# EAGLE design led_table_final (EAGLE 7.6.0)
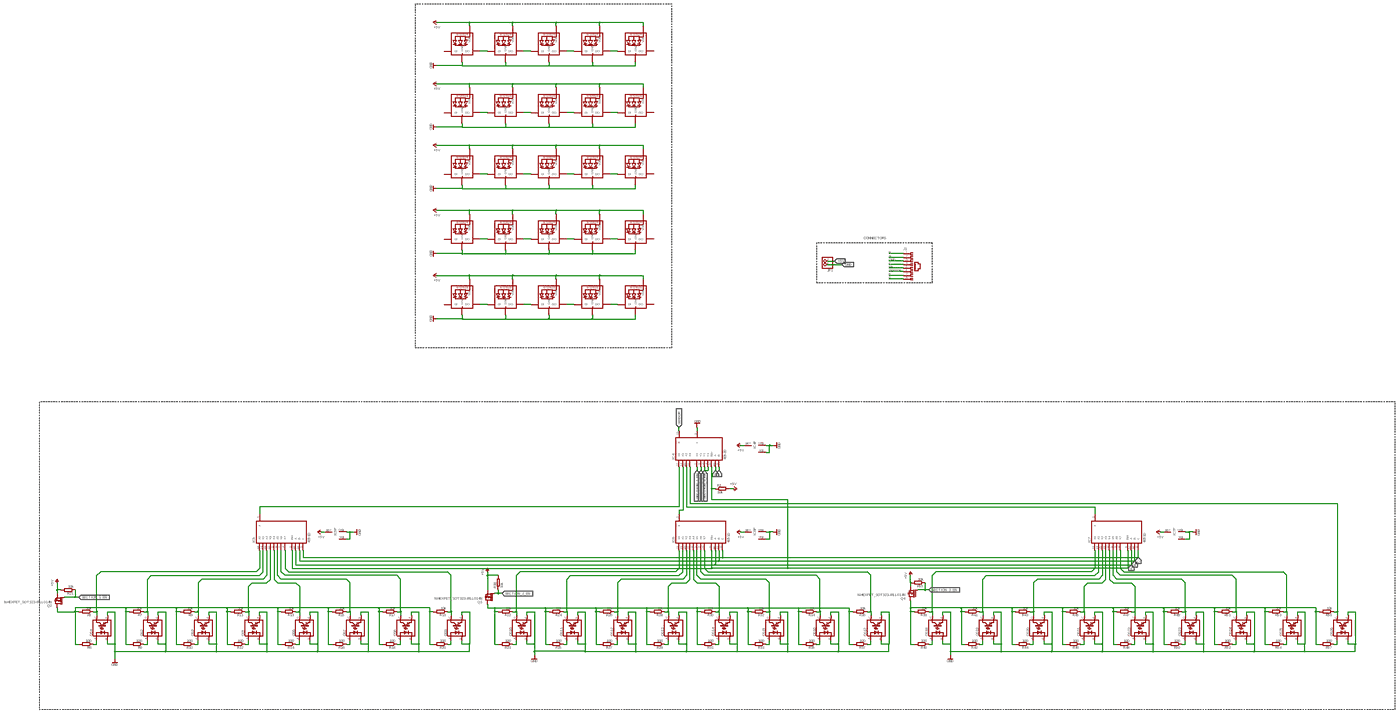
[diagram p0: schematic, sheet 1, overview]
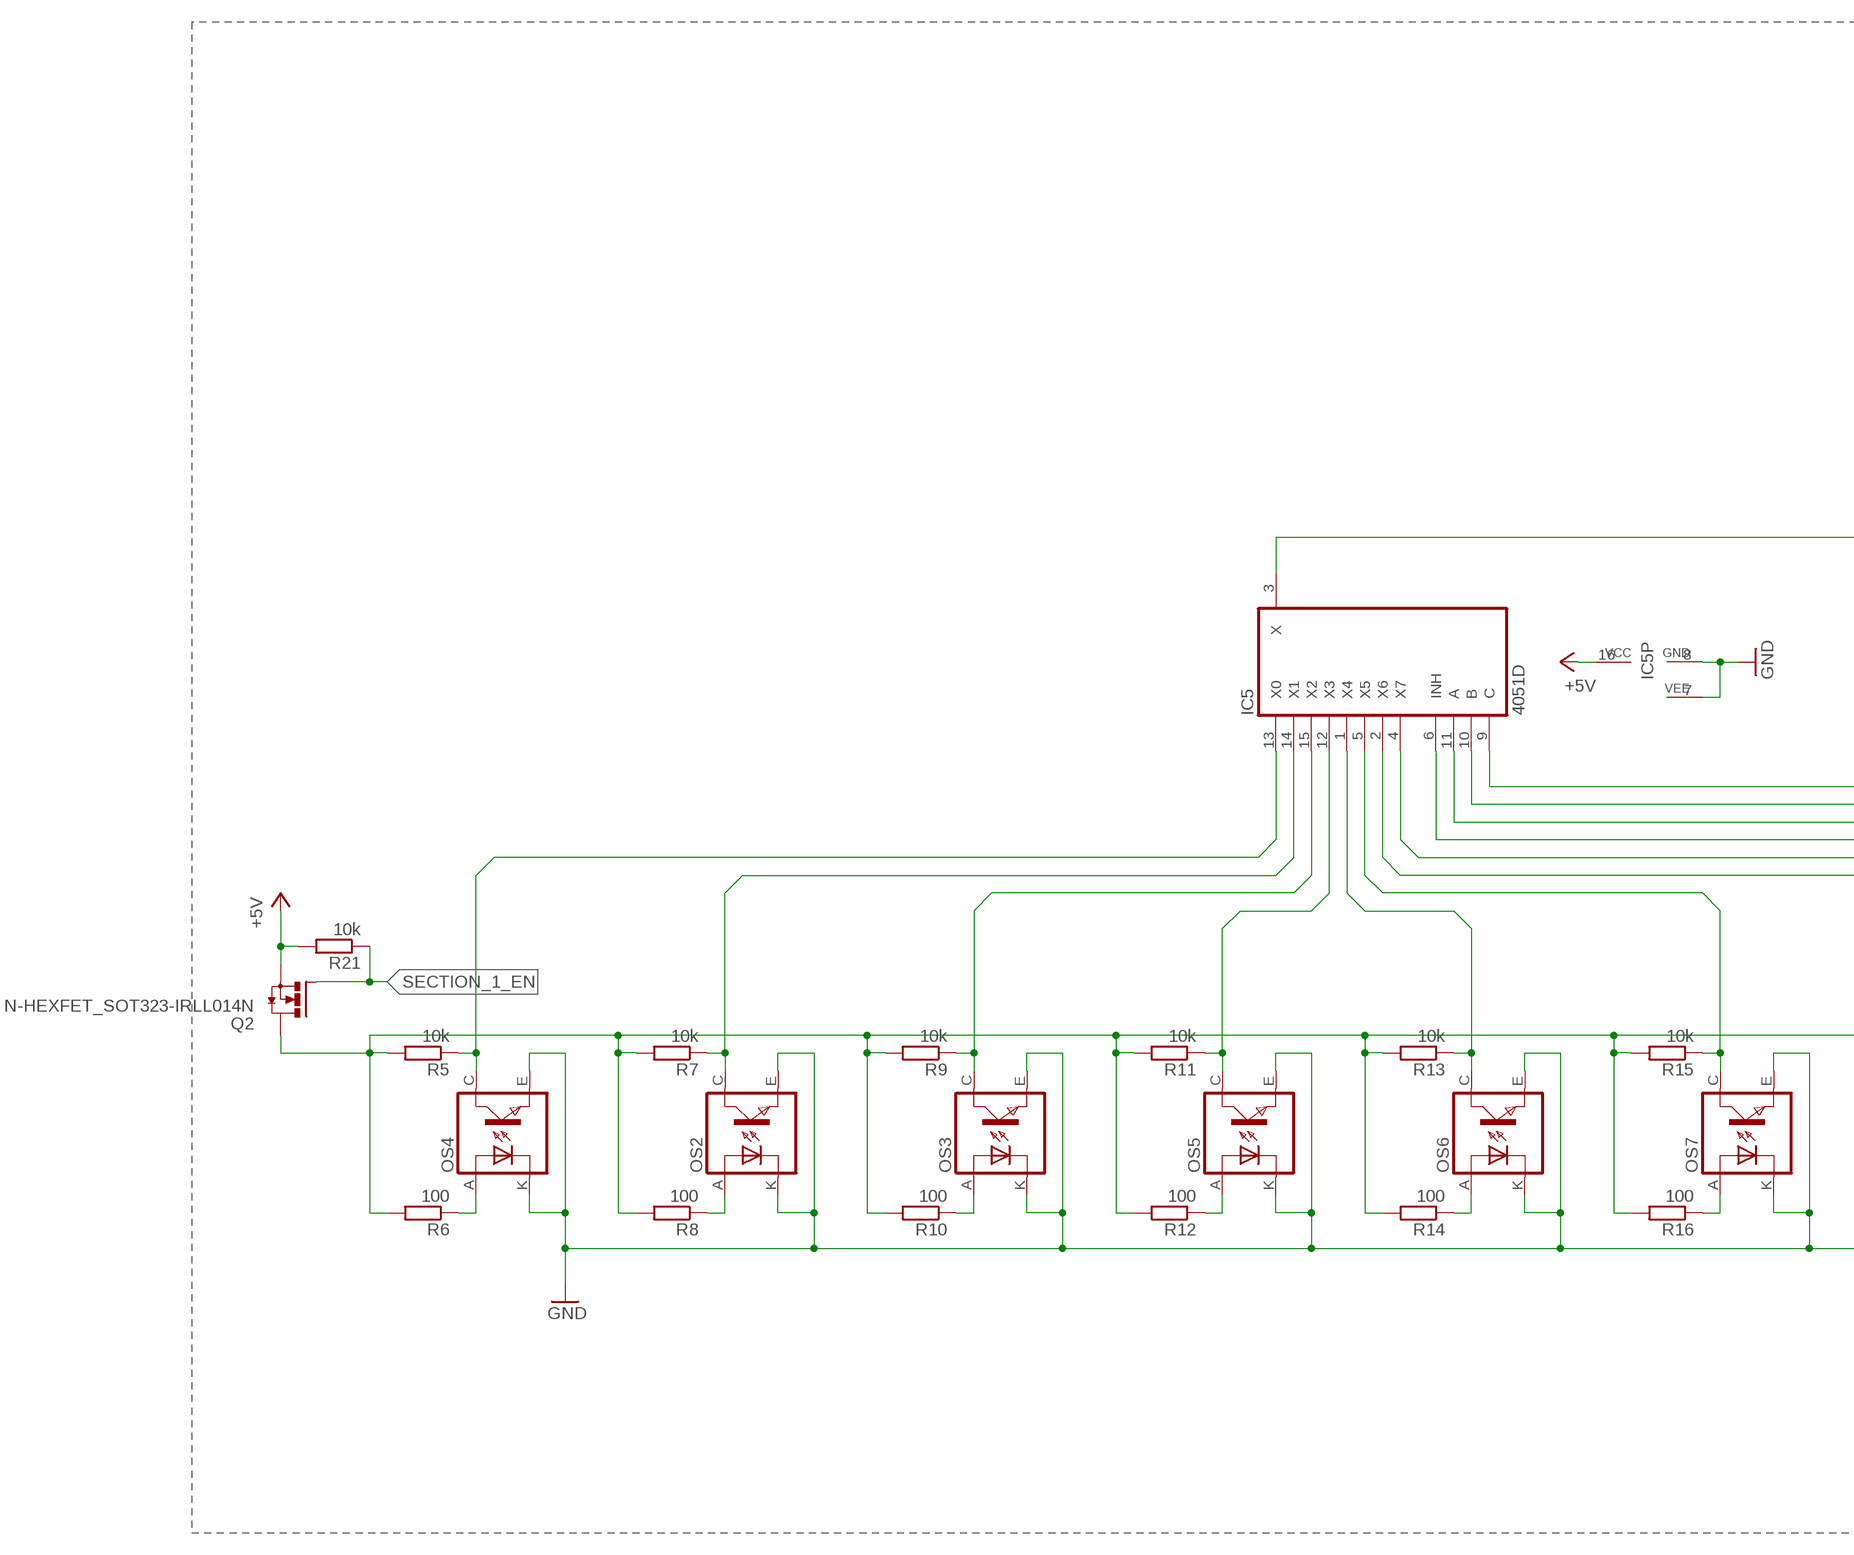
[diagram p1: schematic, sheet 1, part 1 of 4]
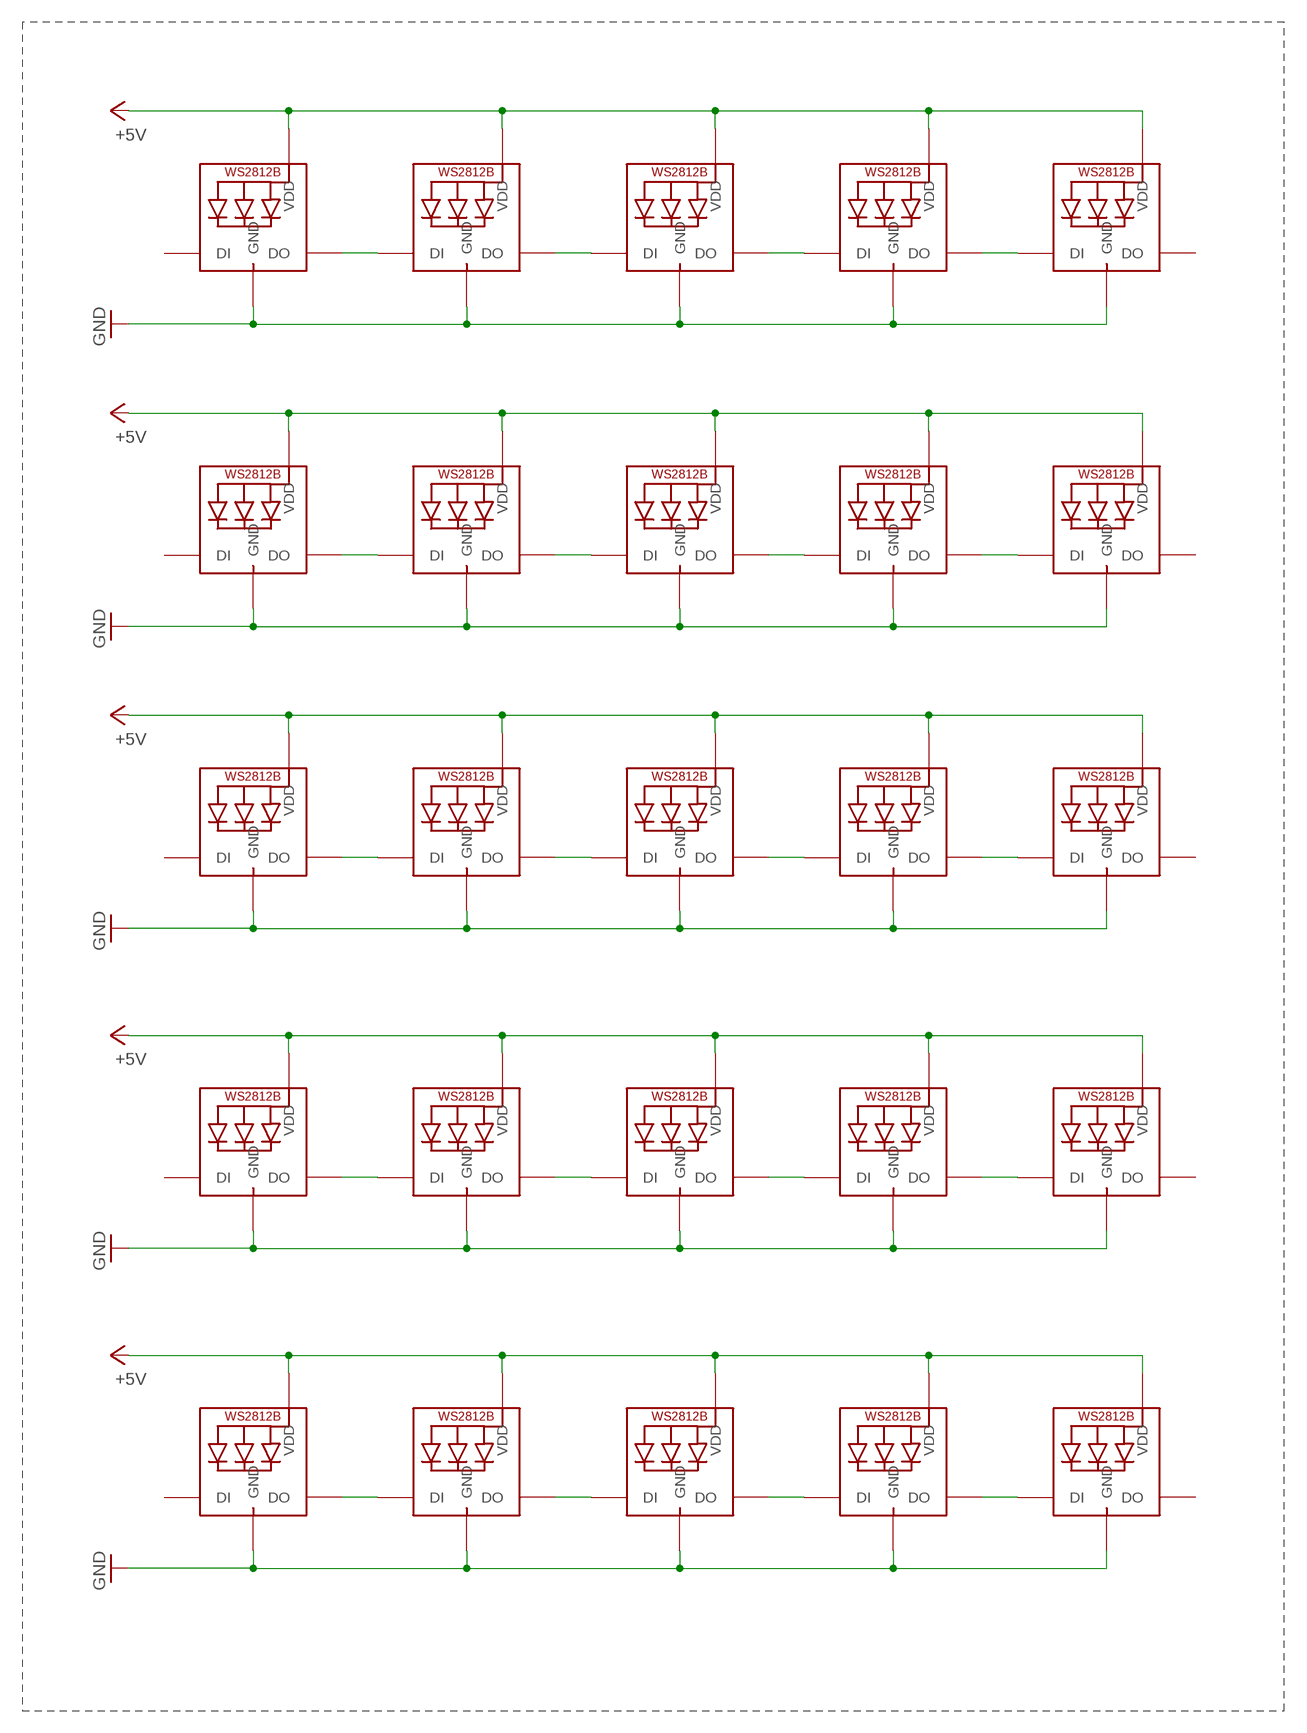
[diagram p2: schematic, sheet 1, part 2 of 4]
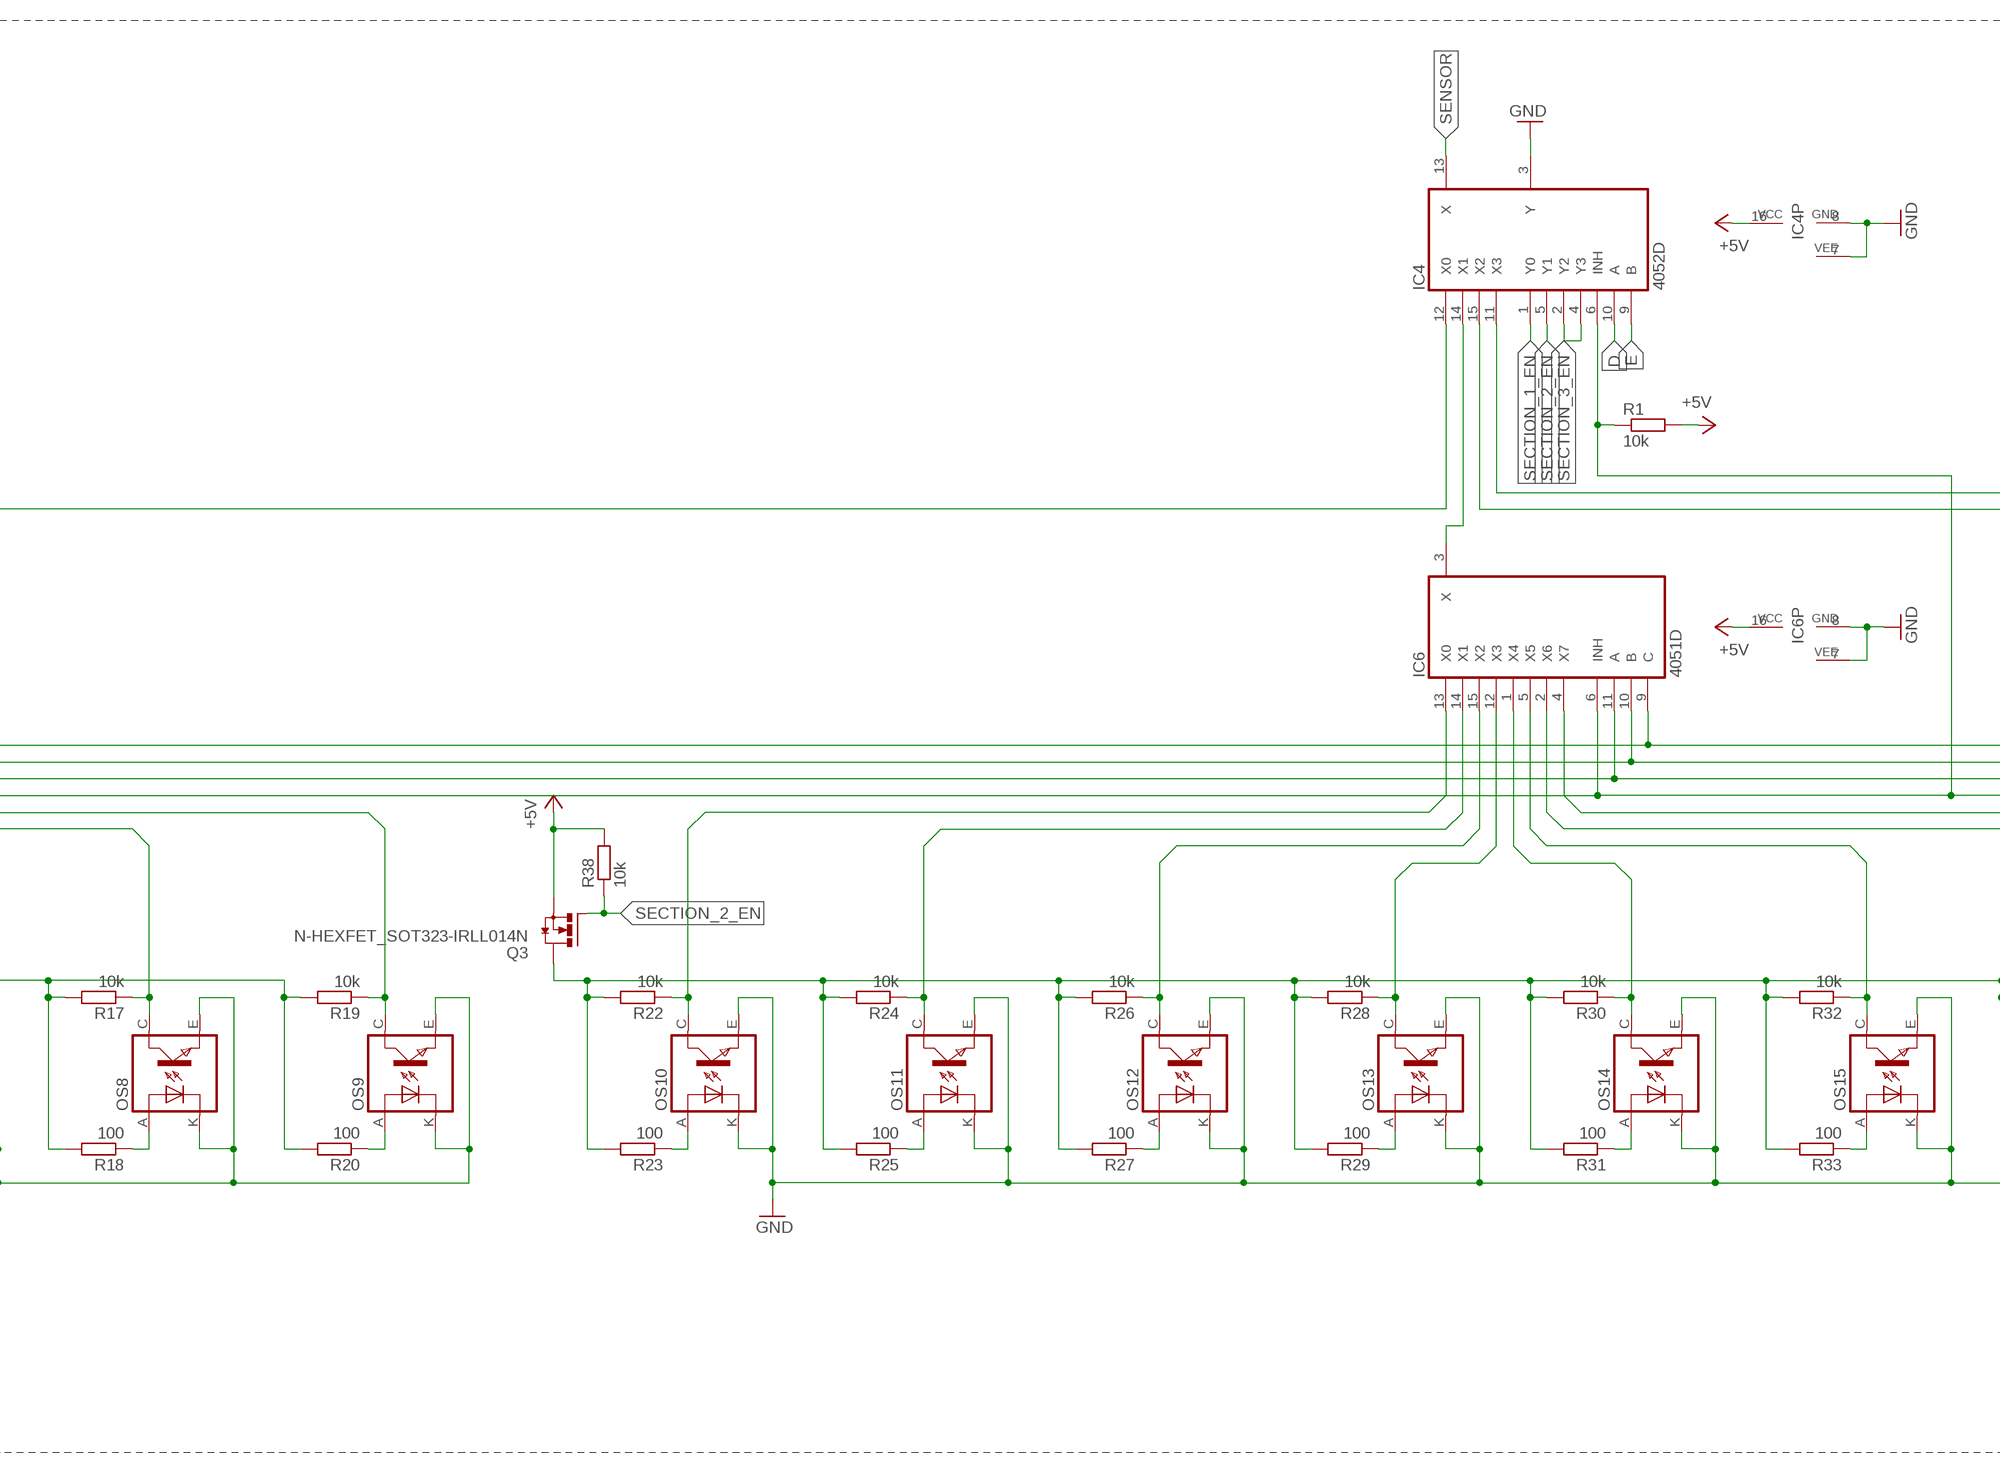
[diagram p3: schematic, sheet 1, part 3 of 4]
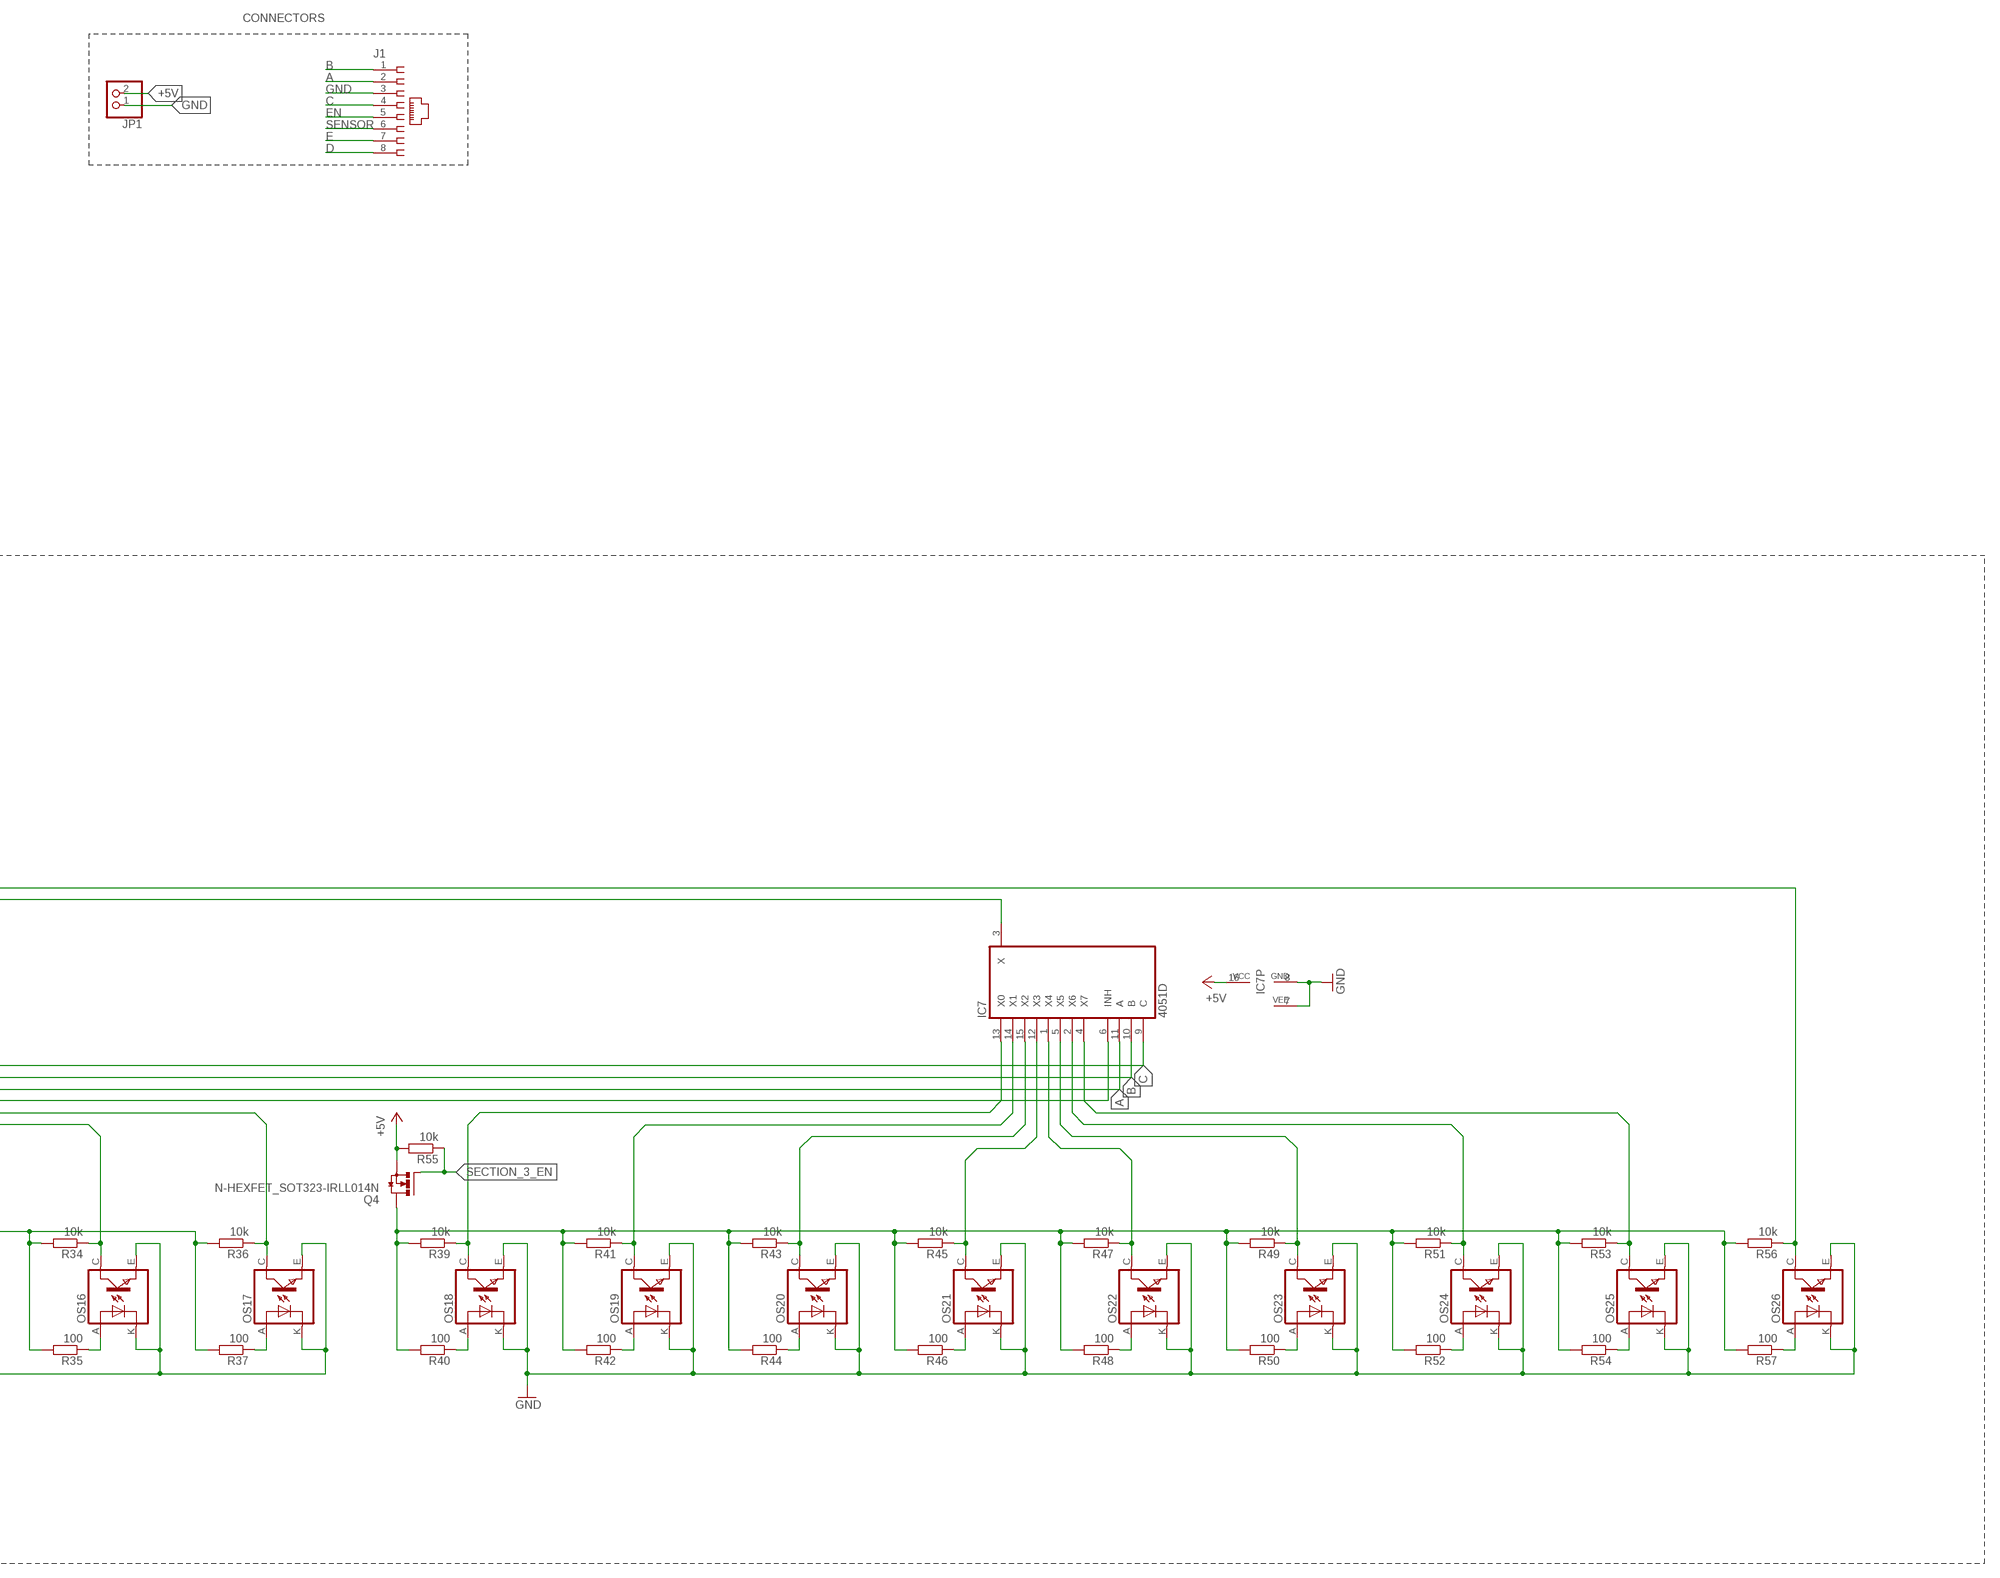
[diagram p4: schematic, sheet 1, part 4 of 4]

## Parts
IC4  4052D  [SO16]
IC5  4051D  [SO16]
IC6  4051D  [SO16]
IC7  4051D  [SO16]
J1  556416-1  [556416-1]
JP1  PINHD-1X2  [1X02]
LED1  WS2812B  [WS2812B_ON_STRIP]
LED2  WS2812B  [WS2812B_ON_STRIP]
LED3  WS2812B  [WS2812B_ON_STRIP]
LED4  WS2812B  [WS2812B_ON_STRIP]
LED5  WS2812B  [WS2812B_ON_STRIP]
LED6  WS2812B  [WS2812B_ON_STRIP]
LED7  WS2812B  [WS2812B_ON_STRIP]
LED8  WS2812B  [WS2812B_ON_STRIP]
LED9  WS2812B  [WS2812B_ON_STRIP]
LED10  WS2812B  [WS2812B_ON_STRIP]
LED11  WS2812B  [WS2812B_ON_STRIP]
LED12  WS2812B  [WS2812B_ON_STRIP]
LED13  WS2812B  [WS2812B_ON_STRIP]
LED14  WS2812B  [WS2812B_ON_STRIP]
LED15  WS2812B  [WS2812B_ON_STRIP]
LED16  WS2812B  [WS2812B_ON_STRIP]
LED17  WS2812B  [WS2812B_ON_STRIP]
LED18  WS2812B  [WS2812B_ON_STRIP]
LED19  WS2812B  [WS2812B_ON_STRIP]
LED20  WS2812B  [WS2812B_ON_STRIP]
LED21  WS2812B  [WS2812B_ON_STRIP]
LED22  WS2812B  [WS2812B_ON_STRIP]
LED23  WS2812B  [WS2812B_ON_STRIP]
LED24  WS2812B  [WS2812B_ON_STRIP]
LED25  WS2812B  [WS2812B_ON_STRIP]
OS2  TCRT5000  [TCRT5000]
OS3  TCRT5000  [TCRT5000]
OS4  TCRT5000  [TCRT5000]
OS5  TCRT5000  [TCRT5000]
OS6  TCRT5000  [TCRT5000]
OS7  TCRT5000  [TCRT5000]
OS8  TCRT5000  [TCRT5000]
OS9  TCRT5000  [TCRT5000]
OS10  TCRT5000  [TCRT5000]
OS11  TCRT5000  [TCRT5000]
OS12  TCRT5000  [TCRT5000]
OS13  TCRT5000  [TCRT5000]
OS14  TCRT5000  [TCRT5000]
OS15  TCRT5000  [TCRT5000]
OS16  TCRT5000  [TCRT5000]
OS17  TCRT5000  [TCRT5000]
OS18  TCRT5000  [TCRT5000]
OS19  TCRT5000  [TCRT5000]
OS20  TCRT5000  [TCRT5000]
OS21  TCRT5000  [TCRT5000]
OS22  TCRT5000  [TCRT5000]
OS23  TCRT5000  [TCRT5000]
OS24  TCRT5000  [TCRT5000]
OS25  TCRT5000  [TCRT5000]
OS26  TCRT5000  [TCRT5000]
Q2  N-HEXFET_SOT323-IRLL014N  [SOT223]
Q3  N-HEXFET_SOT323-IRLL014N  [SOT223]
Q4  N-HEXFET_SOT323-IRLL014N  [SOT223]
R1  10k  R-EU_R1206  [R1206]
R5  10k  R-EU_R1206  [R1206]
R6  100  R-EU_R1206  [R1206]
R7  10k  R-EU_R1206  [R1206]
R8  100  R-EU_R1206  [R1206]
R9  10k  R-EU_R1206  [R1206]
R10  100  R-EU_R1206  [R1206]
R11  10k  R-EU_R1206  [R1206]
R12  100  R-EU_R1206  [R1206]
R13  10k  R-EU_R1206  [R1206]
R14  100  R-EU_R1206  [R1206]
R15  10k  R-EU_R1206  [R1206]
R16  100  R-EU_R1206  [R1206]
R17  10k  R-EU_R1206  [R1206]
R18  100  R-EU_R1206  [R1206]
R19  10k  R-EU_R1206  [R1206]
R20  100  R-EU_R1206  [R1206]
R21  10k  R-EU_R1206  [R1206]
R22  10k  R-EU_R1206  [R1206]
R23  100  R-EU_R1206  [R1206]
R24  10k  R-EU_R1206  [R1206]
R25  100  R-EU_R1206  [R1206]
R26  10k  R-EU_R1206  [R1206]
R27  100  R-EU_R1206  [R1206]
R28  10k  R-EU_R1206  [R1206]
R29  100  R-EU_R1206  [R1206]
R30  10k  R-EU_R1206  [R1206]
R31  100  R-EU_R1206  [R1206]
R32  10k  R-EU_R1206  [R1206]
R33  100  R-EU_R1206  [R1206]
R34  10k  R-EU_R1206  [R1206]
R35  100  R-EU_R1206  [R1206]
R36  10k  R-EU_R1206  [R1206]
R37  100  R-EU_R1206  [R1206]
R38  10k  R-EU_R1206  [R1206]
R39  10k  R-EU_R1206  [R1206]
R40  100  R-EU_R1206  [R1206]
R41  10k  R-EU_R1206  [R1206]
R42  100  R-EU_R1206  [R1206]
R43  10k  R-EU_R1206  [R1206]
R44  100  R-EU_R1206  [R1206]
R45  10k  R-EU_R1206  [R1206]
R46  100  R-EU_R1206  [R1206]
R47  10k  R-EU_R1206  [R1206]
R48  100  R-EU_R1206  [R1206]
R49  10k  R-EU_R1206  [R1206]
R50  100  R-EU_R1206  [R1206]
R51  10k  R-EU_R1206  [R1206]
R52  100  R-EU_R1206  [R1206]
R53  10k  R-EU_R1206  [R1206]
R54  100  R-EU_R1206  [R1206]
R55  10k  R-EU_R1206  [R1206]
R56  10k  R-EU_R1206  [R1206]
R57  100  R-EU_R1206  [R1206]

## Nets
+5V: IC4.16(VCC) IC5.16(VCC) IC6.16(VCC) IC7.16(VCC) JP1.2 LED1.VCC_IN(VDD) LED1.VCC_OUT(VDD) LED2.VCC_IN(VDD) LED2.VCC_OUT(VDD) LED3.VCC_IN(VDD) LED3.VCC_OUT(VDD) LED4.VCC_IN(VDD) LED4.VCC_OUT(VDD) LED5.VCC_IN(VDD) LED5.VCC_OUT(VDD) LED6.VCC_IN(VDD) LED6.VCC_OUT(VDD) LED7.VCC_IN(VDD) LED7.VCC_OUT(VDD) LED8.VCC_IN(VDD) LED8.VCC_OUT(VDD) LED9.VCC_IN(VDD) LED9.VCC_OUT(VDD) LED10.VCC_IN(VDD) LED10.VCC_OUT(VDD) LED11.VCC_IN(VDD) LED11.VCC_OUT(VDD) LED12.VCC_IN(VDD) LED12.VCC_OUT(VDD) LED13.VCC_IN(VDD) LED13.VCC_OUT(VDD) LED14.VCC_IN(VDD) LED14.VCC_OUT(VDD) LED15.VCC_IN(VDD) LED15.VCC_OUT(VDD) LED16.VCC_IN(VDD) LED16.VCC_OUT(VDD) LED17.VCC_IN(VDD) LED17.VCC_OUT(VDD) LED18.VCC_IN(VDD) LED18.VCC_OUT(VDD) LED19.VCC_IN(VDD) LED19.VCC_OUT(VDD) LED20.VCC_IN(VDD) LED20.VCC_OUT(VDD) LED21.VCC_IN(VDD) LED21.VCC_OUT(VDD) LED22.VCC_IN(VDD) LED22.VCC_OUT(VDD) LED23.VCC_IN(VDD) LED23.VCC_OUT(VDD) LED24.VCC_IN(VDD) LED24.VCC_OUT(VDD) LED25.VCC_IN(VDD) LED25.VCC_OUT(VDD) Q2.3(S) Q3.3(S) Q4.3(S) R1.2 R21.2 R38.2 R55.2
A: IC5.11(A) IC6.11(A) IC7.11(A) J1.2
B: IC5.10(B) IC6.10(B) IC7.10(B) J1.1
C: IC5.9(C) IC6.9(C) IC7.9(C) J1.4
D: IC4.10(A) J1.8
E: IC4.9(B) J1.7
EN: IC4.6(INH) IC5.6(INH) IC6.6(INH) IC7.6(INH) J1.5 R1.1
GND: IC4.3(Y) IC4.7(VEE) IC4.8(GND) IC5.7(VEE) IC5.8(GND) IC6.7(VEE) IC6.8(GND) IC7.7(VEE) IC7.8(GND) J1.3 JP1.1 LED1.GND_IN(GND) LED1.GND_OUT(GND) LED2.GND_IN(GND) LED2.GND_OUT(GND) LED3.GND_IN(GND) LED3.GND_OUT(GND) LED4.GND_IN(GND) LED4.GND_OUT(GND) LED5.GND_IN(GND) LED5.GND_OUT(GND) LED6.GND_IN(GND) LED6.GND_OUT(GND) LED7.GND_IN(GND) LED7.GND_OUT(GND) LED8.GND_IN(GND) LED8.GND_OUT(GND) LED9.GND_IN(GND) LED9.GND_OUT(GND) LED10.GND_IN(GND) LED10.GND_OUT(GND) LED11.GND_IN(GND) LED11.GND_OUT(GND) LED12.GND_IN(GND) LED12.GND_OUT(GND) LED13.GND_IN(GND) LED13.GND_OUT(GND) LED14.GND_IN(GND) LED14.GND_OUT(GND) LED15.GND_IN(GND) LED15.GND_OUT(GND) LED16.GND_IN(GND) LED16.GND_OUT(GND) LED17.GND_IN(GND) LED17.GND_OUT(GND) LED18.GND_IN(GND) LED18.GND_OUT(GND) LED19.GND_IN(GND) LED19.GND_OUT(GND) LED20.GND_IN(GND) LED20.GND_OUT(GND) LED21.GND_IN(GND) LED21.GND_OUT(GND) LED22.GND_IN(GND) LED22.GND_OUT(GND) LED23.GND_IN(GND) LED23.GND_OUT(GND) LED24.GND_IN(GND) LED24.GND_OUT(GND) LED25.GND_IN(GND) LED25.GND_OUT(GND) OS2.E(EMITTER) OS2.K(CATHODE) OS3.E(EMITTER) OS3.K(CATHODE) OS4.E(EMITTER) OS4.K(CATHODE) OS5.E(EMITTER) OS5.K(CATHODE) OS6.E(EMITTER) OS6.K(CATHODE) OS7.E(EMITTER) OS7.K(CATHODE) OS8.E(EMITTER) OS8.K(CATHODE) OS9.E(EMITTER) OS9.K(CATHODE) OS10.E(EMITTER) OS10.K(CATHODE) OS11.E(EMITTER) OS11.K(CATHODE) OS12.E(EMITTER) OS12.K(CATHODE) OS13.E(EMITTER) OS13.K(CATHODE) OS14.E(EMITTER) OS14.K(CATHODE) OS15.E(EMITTER) OS15.K(CATHODE) OS16.E(EMITTER) OS16.K(CATHODE) OS17.E(EMITTER) OS17.K(CATHODE) OS18.E(EMITTER) OS18.K(CATHODE) OS19.E(EMITTER) OS19.K(CATHODE) OS20.E(EMITTER) OS20.K(CATHODE) OS21.E(EMITTER) OS21.K(CATHODE) OS22.E(EMITTER) OS22.K(CATHODE) OS23.E(EMITTER) OS23.K(CATHODE) OS24.E(EMITTER) OS24.K(CATHODE) OS25.E(EMITTER) OS25.K(CATHODE) OS26.E(EMITTER) OS26.K(CATHODE)
N$1: Q3.4(D) R22.2 R23.2 R24.2 R25.2 R26.2 R27.2 R28.2 R29.2 R30.2 R31.2 R32.2 R33.2 R34.2 R35.2 R36.2 R37.2
N$7: Q2.4(D) R5.2 R6.2 R7.2 R8.2 R9.2 R10.2 R11.2 R12.2 R13.2 R14.2 R15.2 R16.2 R17.2 R18.2 R19.2 R20.2
N$11: OS4.A(ANODE) R6.1
N$12: IC5.13(X0) OS4.C(COLLECTOR) R5.1
N$13: IC5.14(X1) OS2.C(COLLECTOR) R7.1
N$14: IC5.15(X2) OS3.C(COLLECTOR) R9.1
N$15: OS2.A(ANODE) R8.1
N$16: IC5.1(X4) OS6.C(COLLECTOR) R13.1
N$17: IC6.13(X0) OS10.C(COLLECTOR) R22.1
N$18: OS3.A(ANODE) R10.1
N$19: OS10.A(ANODE) R23.1
N$20: IC5.12(X3) OS5.C(COLLECTOR) R11.1
N$21: OS5.A(ANODE) R12.1
N$22: IC6.14(X1) OS11.C(COLLECTOR) R24.1
N$23: OS11.A(ANODE) R25.1
N$24: OS6.A(ANODE) R14.1
N$25: OS12.A(ANODE) R27.1
N$26: IC5.5(X5) OS7.C(COLLECTOR) R15.1
N$27: OS7.A(ANODE) R16.1
N$28: IC6.12(X3) OS13.C(COLLECTOR) R28.1
N$29: IC5.2(X6) OS8.C(COLLECTOR) R17.1
N$30: OS8.A(ANODE) R18.1
N$32: IC5.4(X7) OS9.C(COLLECTOR) R19.1
N$33: OS9.A(ANODE) R20.1
N$34: OS13.A(ANODE) R29.1
N$36: OS14.A(ANODE) R31.1
N$37: IC6.5(X5) OS15.C(COLLECTOR) R32.1
N$38: OS15.A(ANODE) R33.1
N$39: IC6.2(X6) OS16.C(COLLECTOR) R34.1
N$40: OS16.A(ANODE) R35.1
N$42: IC6.4(X7) OS17.C(COLLECTOR) R36.1
N$43: OS17.A(ANODE) R37.1
N$45: IC6.15(X2) OS12.C(COLLECTOR) R26.1
N$46: IC6.1(X4) OS14.C(COLLECTOR) R30.1
N$47: IC7.13(X0) OS18.C(COLLECTOR) R39.1
N$48: OS18.A(ANODE) R40.1
N$49: IC7.14(X1) OS19.C(COLLECTOR) R41.1
N$50: OS19.A(ANODE) R42.1
N$51: OS20.A(ANODE) R44.1
N$52: IC7.12(X3) OS21.C(COLLECTOR) R45.1
N$53: OS21.A(ANODE) R46.1
N$54: OS22.A(ANODE) R48.1
N$55: IC7.5(X5) OS23.C(COLLECTOR) R49.1
N$56: OS23.A(ANODE) R50.1
N$57: IC7.2(X6) OS24.C(COLLECTOR) R51.1
N$58: OS24.A(ANODE) R52.1
N$60: IC7.4(X7) OS25.C(COLLECTOR) R53.1
N$61: OS25.A(ANODE) R54.1
N$63: IC7.15(X2) OS20.C(COLLECTOR) R43.1
N$64: IC7.1(X4) OS22.C(COLLECTOR) R47.1
N$68: Q4.4(D) R39.2 R40.2 R41.2 R42.2 R43.2 R44.2 R45.2 R46.2 R47.2 R48.2 R49.2 R50.2 R51.2 R52.2 R53.2 R54.2 R56.2 R57.2
N$69: IC4.12(X0) IC5.3(X)
N$70: IC4.14(X1) IC6.3(X)
N$71: IC4.15(X2) IC7.3(X)
N$72: IC4.11(X3) OS26.C(COLLECTOR) R56.1
N$75: OS26.A(ANODE) R57.1
N$117: LED1.D_OUT(DO) LED2.D_IN(DI)
N$118: LED2.D_OUT(DO) LED3.D_IN(DI)
N$119: LED3.D_OUT(DO) LED4.D_IN(DI)
N$120: LED4.D_OUT(DO) LED5.D_IN(DI)
N$123: LED6.D_OUT(DO) LED7.D_IN(DI)
N$124: LED7.D_OUT(DO) LED8.D_IN(DI)
N$125: LED8.D_OUT(DO) LED9.D_IN(DI)
N$126: LED9.D_OUT(DO) LED10.D_IN(DI)
N$127: LED11.D_OUT(DO) LED12.D_IN(DI)
N$128: LED12.D_OUT(DO) LED13.D_IN(DI)
N$129: LED13.D_OUT(DO) LED14.D_IN(DI)
N$130: LED14.D_OUT(DO) LED15.D_IN(DI)
N$131: LED16.D_OUT(DO) LED17.D_IN(DI)
N$132: LED17.D_OUT(DO) LED18.D_IN(DI)
N$133: LED18.D_OUT(DO) LED19.D_IN(DI)
N$134: LED19.D_OUT(DO) LED20.D_IN(DI)
N$135: LED21.D_OUT(DO) LED22.D_IN(DI)
N$136: LED22.D_OUT(DO) LED23.D_IN(DI)
N$137: LED23.D_OUT(DO) LED24.D_IN(DI)
N$138: LED24.D_OUT(DO) LED25.D_IN(DI)
SECTION_1_EN: IC4.1(Y0) Q2.1(G) R21.1
SECTION_2_EN: IC4.5(Y1) Q3.1(G) R38.1
SECTION_3_EN: IC4.2(Y2) IC4.4(Y3) Q4.1(G) R55.1
SENSOR: IC4.13(X) J1.6
Unconnected: LED1.D_IN(DI) LED5.D_OUT(DO) LED6.D_IN(DI) LED10.D_OUT(DO) LED11.D_IN(DI) LED15.D_OUT(DO) LED16.D_IN(DI) LED20.D_OUT(DO) LED21.D_IN(DI) LED25.D_OUT(DO)

## Notes on the sheet
- CONNECTORS

## Library data of the parts
IC4 = 40xx:4052: Dual 4-channel ANALOG MULTIPLEXER
IC5-IC7 = 40xx:4051: 8-channel ANALOG MULTIPLEXER
J1 = con-amp:556416-1: AMP connector
JP1 = pinhead:PINHD-1X2: PIN HEADER
LED1-LED25 = adafruit:WS2812B
OS2-OS26 = tcrt5000:TCRT5000
Q2-Q4 = transistor-power:N-HEXFET_?-*: HEXFET® Power MOSFET
R1 R5-R57 = rcl:R-EU_: RESISTOR, European symbol

## Board
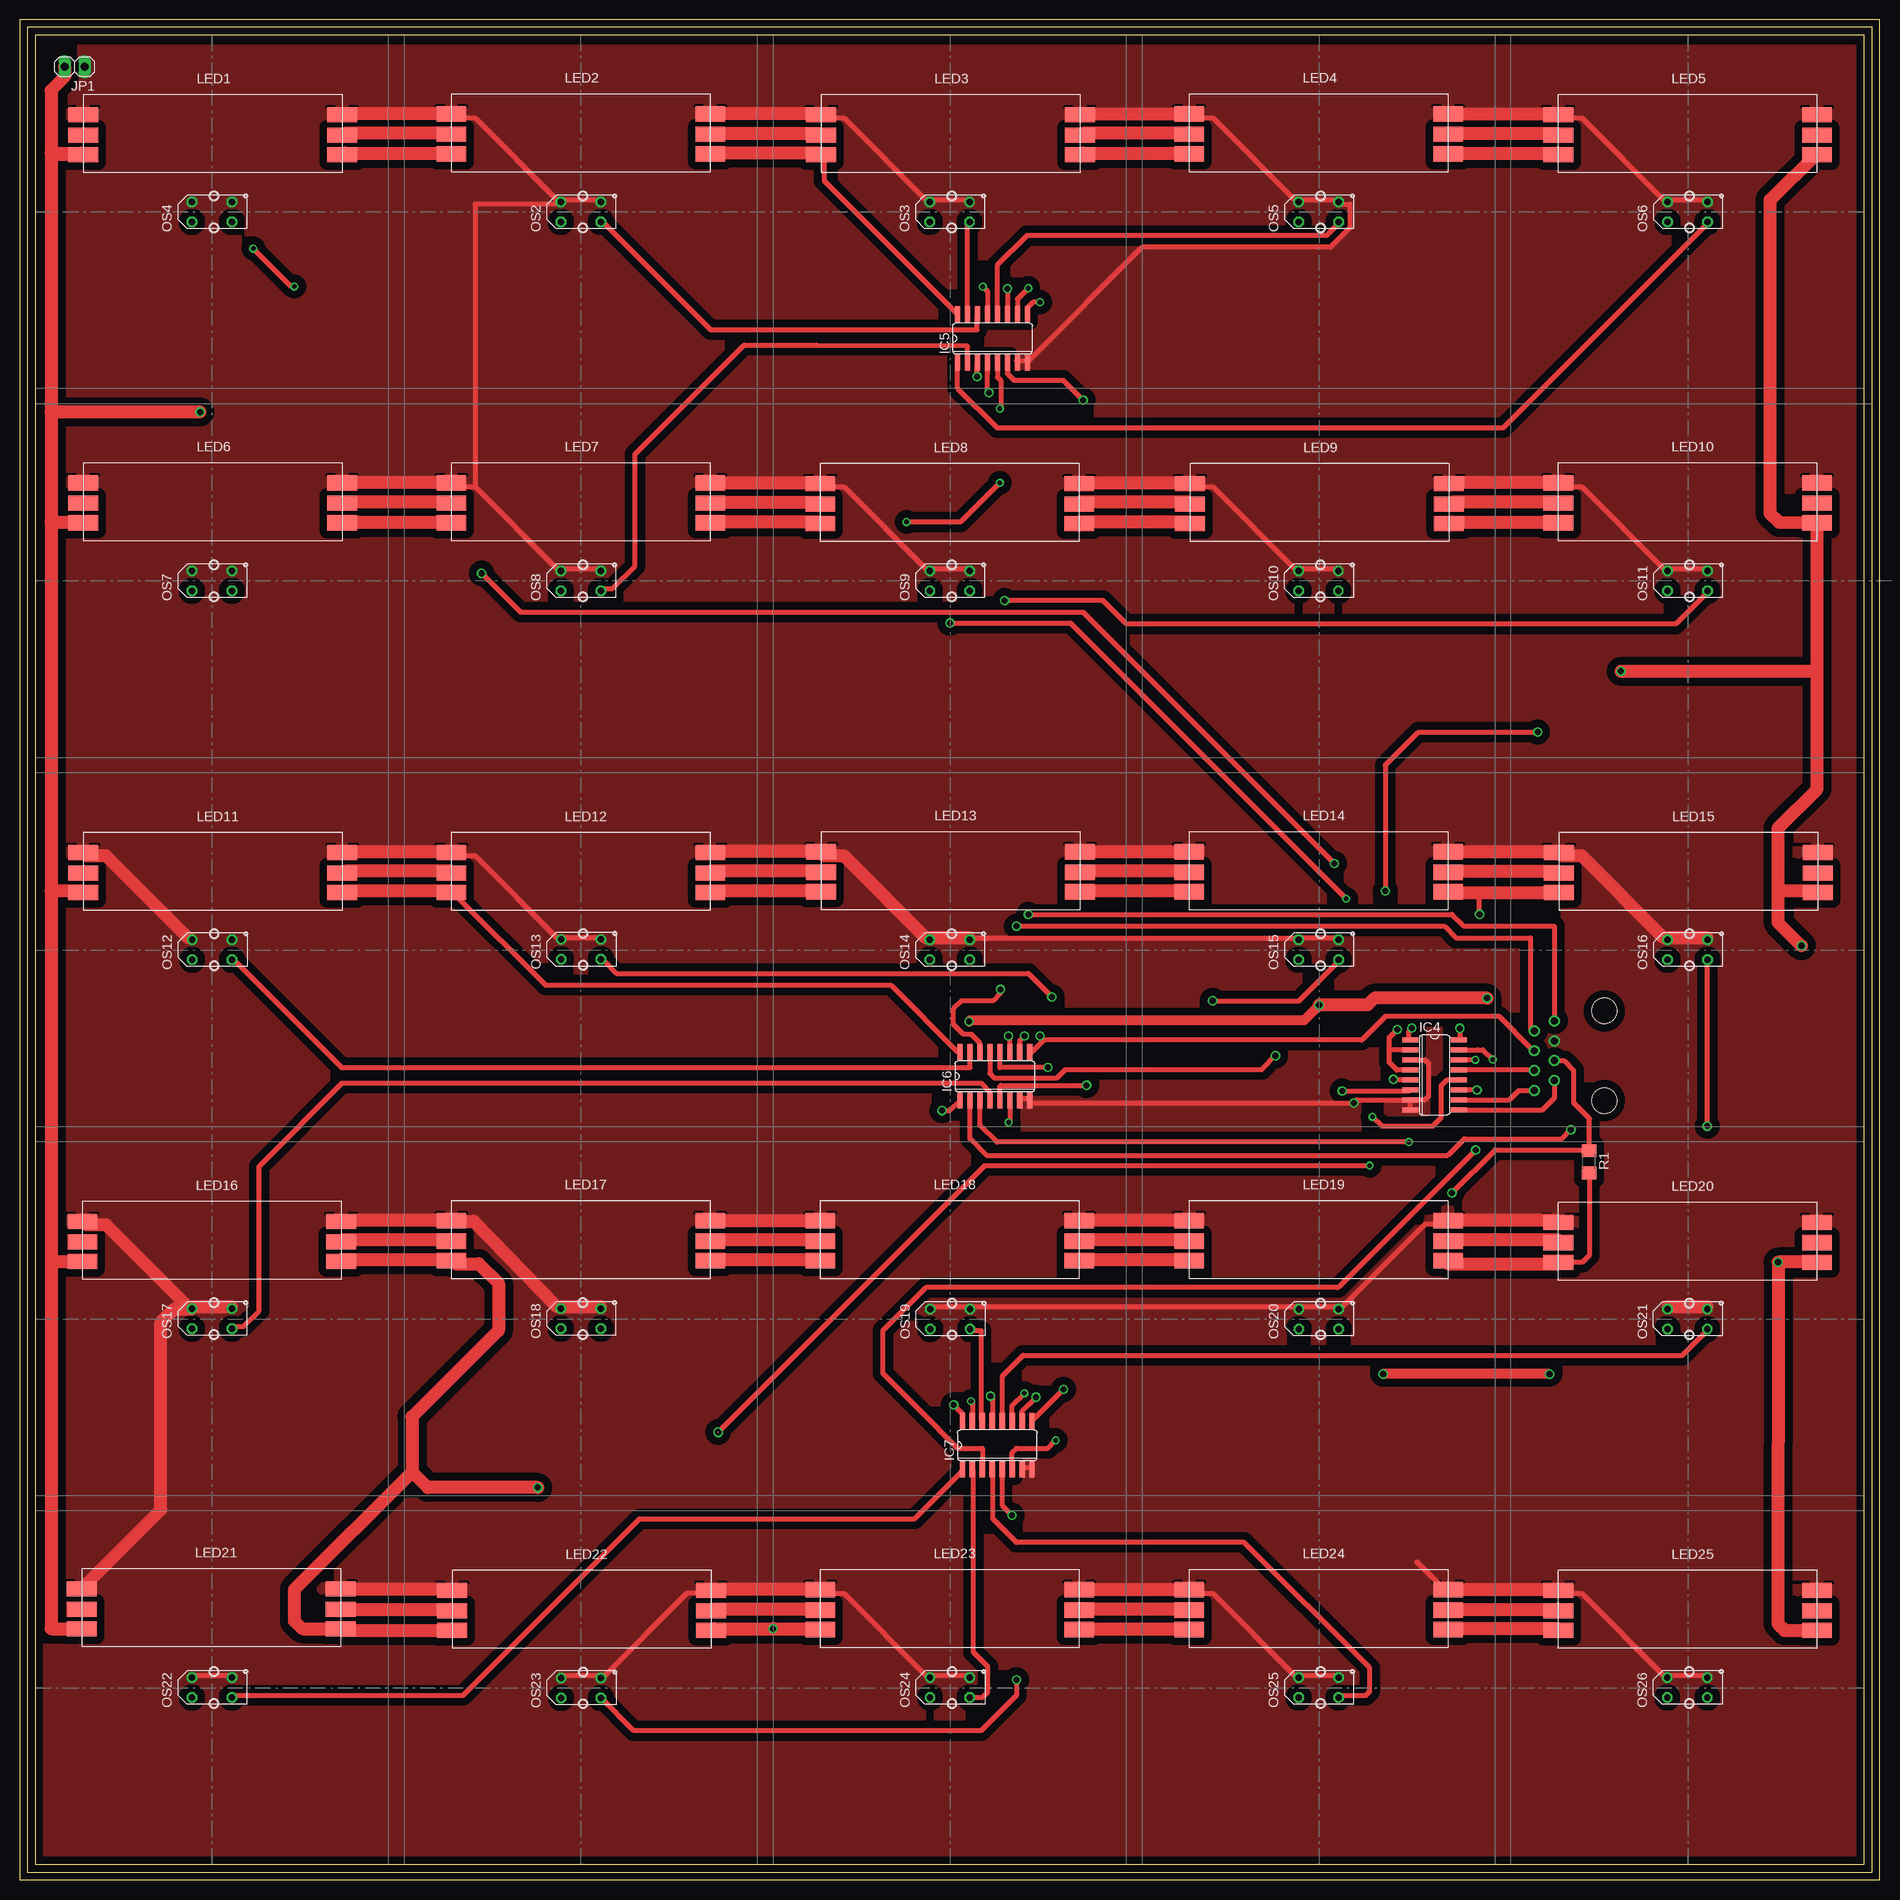
[diagram p5: board, top side]
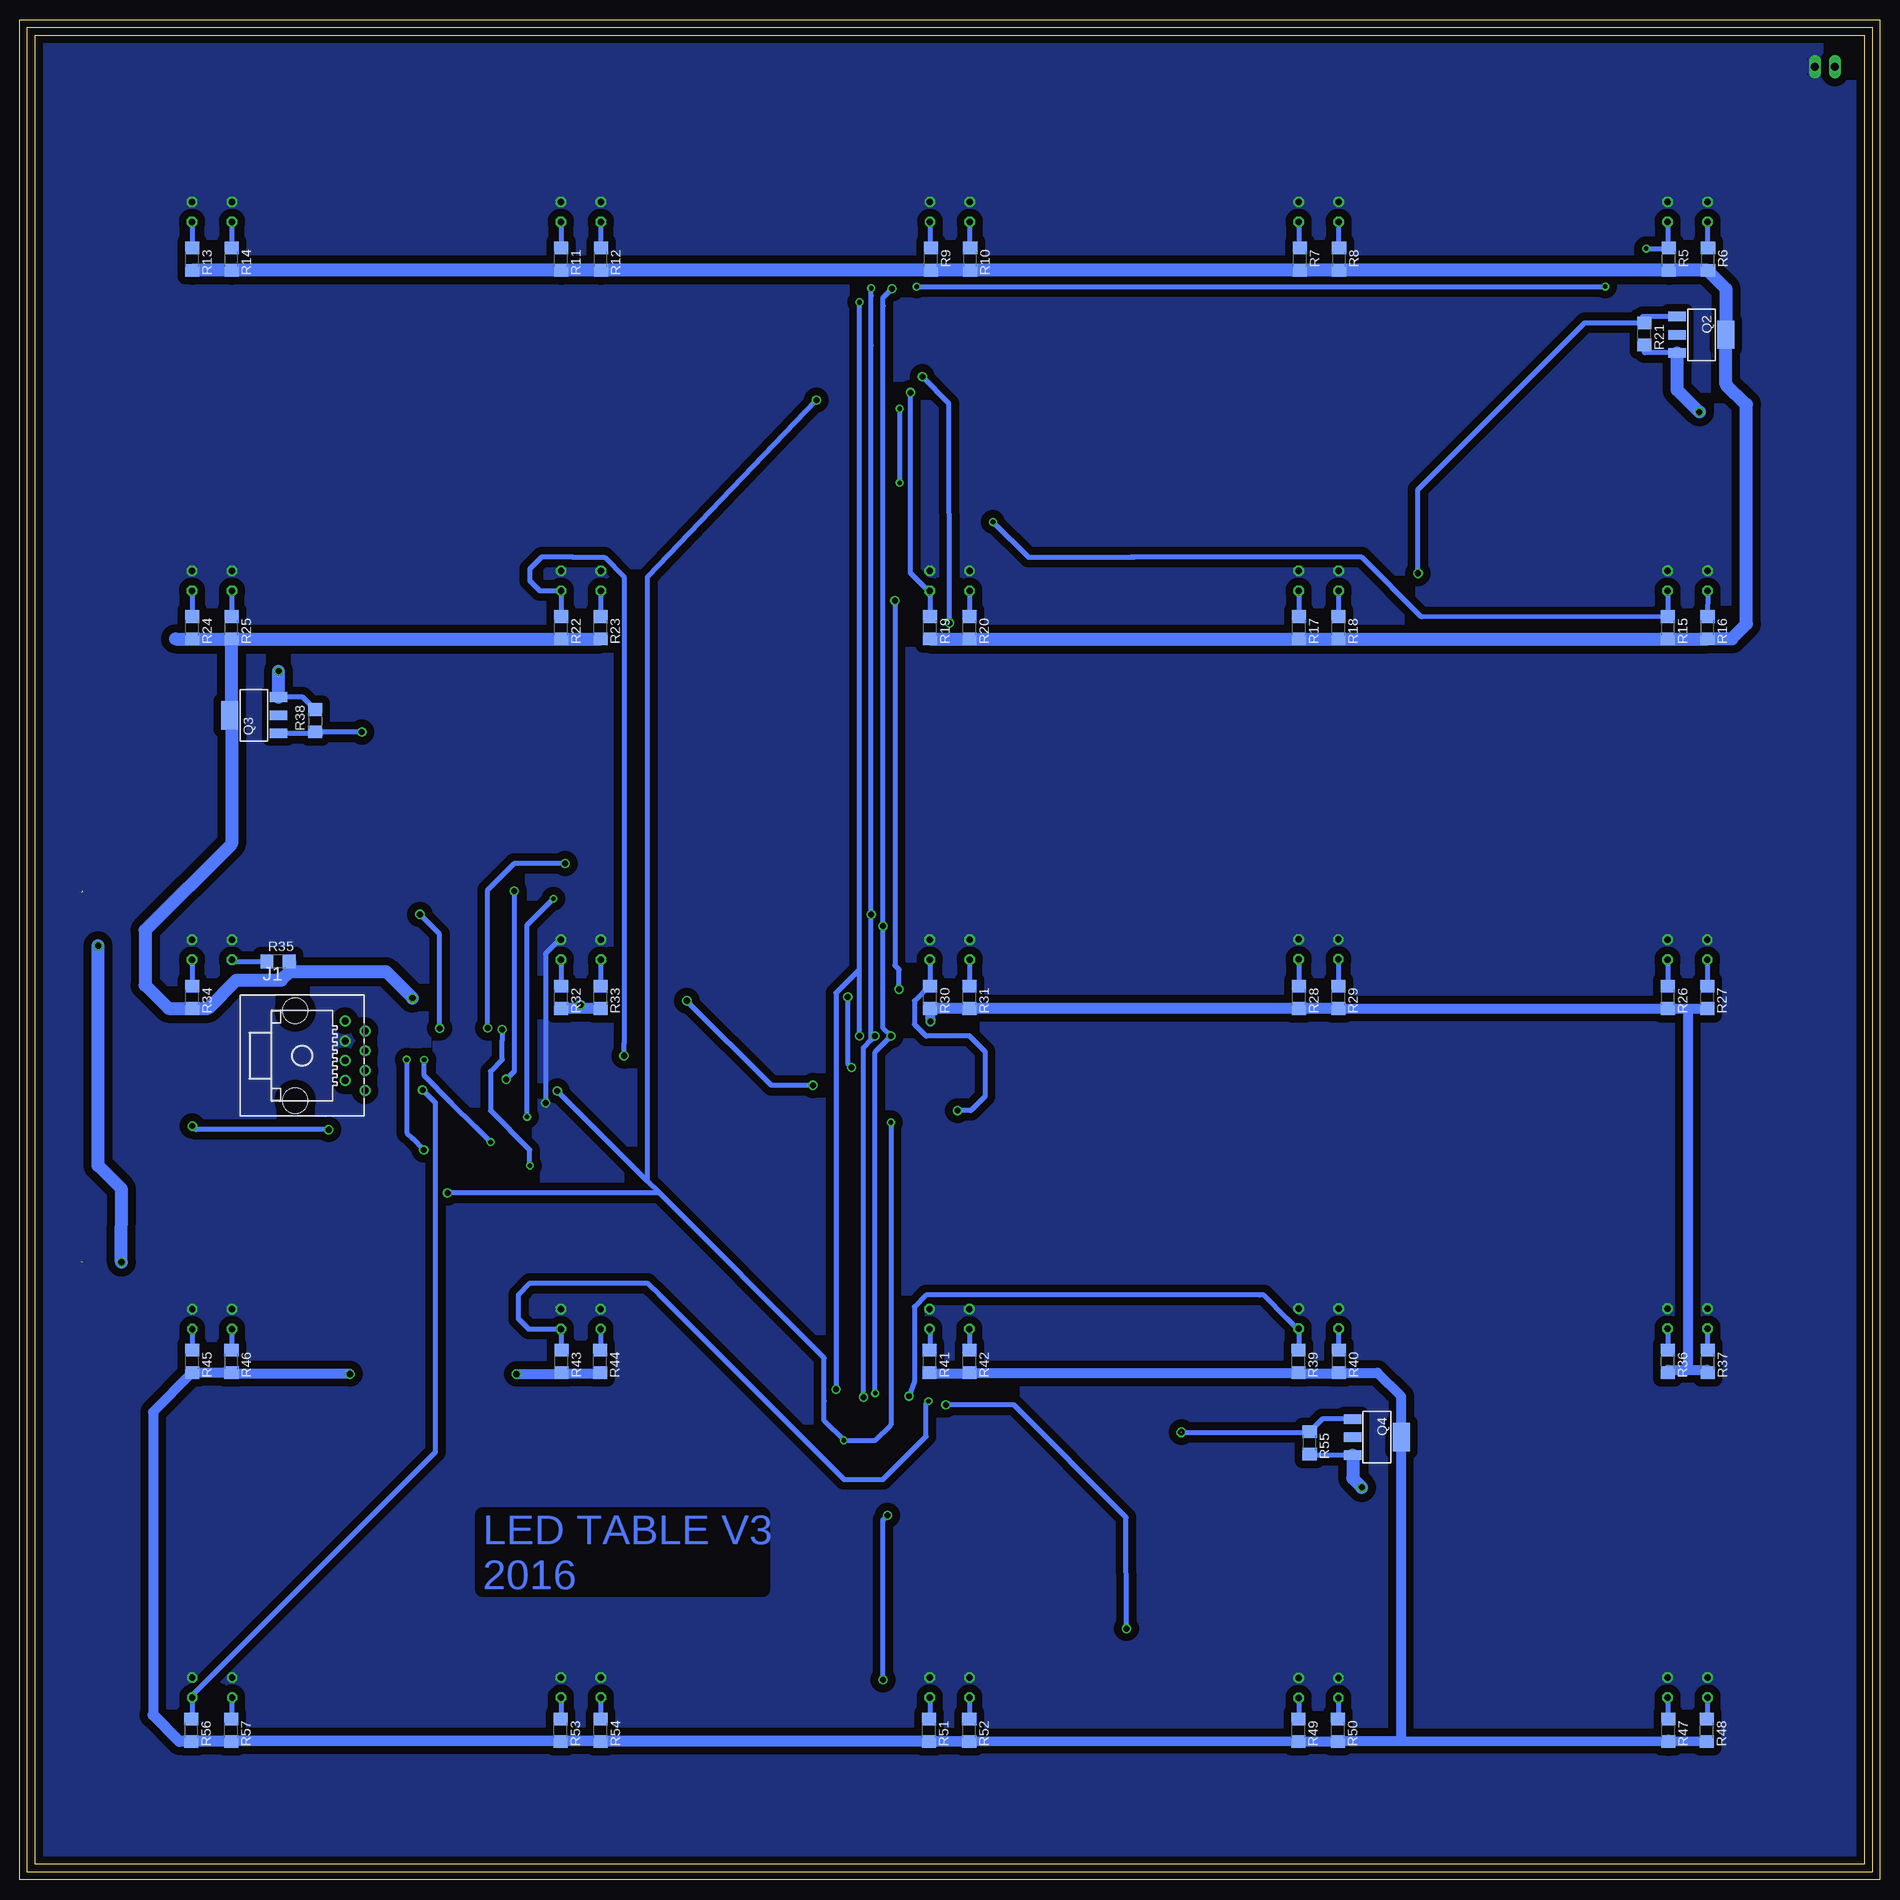
[diagram p6: board, bottom side, seen from below]

Size 237 x 237 mm. Coordinates in mm from the lower left corner, seen from the top.
Outline: 235,235 2,235 2,2 235,2 235,235
Outline: 1,236 1,1 236,1 236,236 1,236
Outline: 0,237 0,0 237,0 237,237 0,237
Copper layers (1*16): Top 0.035mm / dielectric 1.5mm / Bottom 0.035mm
Design rules "default *": minimum track width 25mil, minimum drill 30mil, track to track 15mil, track to pad 15mil, pad to pad 8mil, via to via 8mil, smd to smd 8mil, copper to edge 20mil, drill to drill 8mil, minimum pad ring 10mil, minimum via ring 8mil, stop-mask expansion 4mil, vias tented up to drill 0mil, thermal gap 10mil

### Footprints (pad centres in the part's own frame; a part is rotated, then mirrored left to right if it is on the bottom)
SO16 = smd 0.66 x 2.032: 1 -4.445,-3.073; 2 -3.175,-3.073; 3 -1.905,-3.073; 4 -0.635,-3.073; 5 0.635,-3.073; 6 1.905,-3.073; 7 3.175,-3.073; 8 4.445,-3.073; 9 4.445,3.073; 10 3.175,3.073; 11 1.905,3.073; 12 0.635,3.073; 13 -0.635,3.073; 14 -1.905,3.073; 15 -3.175,3.073; 16 -4.445,3.073
556416-1 = drill 0.889: 1 -4.445,5.461; 2 -3.175,8.001; 3 -1.905,5.461; 4 -0.635,8.001; 5 0.635,5.461; 6 1.905,8.001; 7 3.175,5.461; 8 4.445,8.001 | hole 3.251: -5.715,-0.889; 5.715,-0.889
1X02 = drill 1.016 long: 1 -1.27,0; 2 1.27,0
WS2812B_ON_STRIP = smd 1.93 x 3.81: D_IN 0.12,-16.49; D_OUT 0.12,16.49; GND_IN -2.48,-16.49; GND_OUT -2.48,16.49; VCC_IN 2.62,-16.49; VCC_OUT 2.62,16.49
TCRT5000 = drill 0.8 octagon: A -2.54,-1.27; C 2.54,-1.27; E 2.54,1.27; K -2.54,1.27
SOT223 = smd 1.219 x 2.235: 1 -2.311,-3.099; 2 0,-3.099; 3 2.311,-3.099 | smd 3.6 x 2.2: 4 0,3.099
R1206 = smd 1.6 x 1.803: 1 -1.422,0; 2 1.422,0

### Placement (x,y rotation side)
IC4  180.28,102.54 270 top
IC5  123.95,196.38 0 top
IC6  124.25,102.38 0 top
IC7  124.55,55.38 0 top
J1  201,105 270 bottom
JP1  7,231 180 top
LED1  24.6,222.4 270 top
LED2  71.5,222.5 270 top
LED3  118.6,222.4 270 top
LED4  165.5,222.5 270 top
LED5  212.5,222.4 270 top
LED6  24.6,175.5 270 top
LED7  71.5,175.5 270 top
LED8  118.5,175.4 270 top
LED9  165.6,175.4 270 top
LED10  212.5,175.5 270 top
LED11  24.6,128.4 270 top
LED12  71.5,128.4 270 top
LED13  118.6,128.5 270 top
LED14  165.5,128.5 270 top
LED15  212.6,128.4 270 top
LED16  24.5,81.4 270 top
LED17  71.5,81.5 270 top
LED18  118.5,81.5 270 top
LED19  165.5,81.5 270 top
LED20  212.5,81.3 270 top
LED21  24.4,34.6 270 top
LED22  71.6,34.4 270 top
LED23  118.5,34.5 270 top
LED24  165.5,34.5 270 top
LED25  212.5,34.4 270 top
OS2  71.5,212.5 0 top
OS3  118.49,212.5 0 top
OS4  24.5,212.5 0 top
OS5  165.5,212.5 0 top
OS6  212.5,212.5 0 top
OS7  24.5,165.5 0 top
OS8  71.5,165.5 0 top
OS9  118.51,165.5 0 top
OS10  165.48,165.5 0 top
OS11  212.5,165.5 0 top
OS12  24.52,118.5 0 top
OS13  71.52,118.55 0 top
OS14  118.5,118.5 0 top
OS15  165.5,118.5 0 top
OS16  212.5,118.5 0 top
OS17  24.5,71.5 0 top
OS18  71.5,71.5 0 top
OS19  118.54,71.45 0 top
OS20  165.51,71.45 0 top
OS21  212.48,71.45 0 top
OS22  24.5,24.5 0 top
OS23  71.52,24.45 0 top
OS24  118.52,24.5 0 top
OS25  165.49,24.5 0 top
OS26  212.46,24.5 0 top
Q2  22.72,196.85 270 bottom
Q3  207.15,148.38 90 bottom
Q4  64.07,56.41 270 bottom
R1  199.96,91.49 270 top
R5  26.89,206.49 270 bottom
R6  21.89,206.49 270 bottom
R7  73.89,206.49 270 bottom
R8  68.89,206.49 270 bottom
R9  120.89,206.49 270 bottom
R10  115.89,206.49 270 bottom
R11  168.01,206.49 270 bottom
R12  162.94,206.49 270 bottom
R13  215,206.49 270 bottom
R14  210,206.49 270 bottom
R15  27,159.52 270 bottom
R16  21.96,159.52 270 bottom
R17  74,159.52 270 bottom
R18  69,159.52 270 bottom
R19  121,159.52 270 bottom
R20  116,159.52 270 bottom
R21  30,196.96 270 bottom
R22  168,159.52 270 bottom
R23  163,159.52 270 bottom
R24  215,159.52 270 bottom
R25  210,159.52 270 bottom
R26  27,112.44 270 bottom
R27  22,112.44 270 bottom
R28  74,112.44 270 bottom
R29  69,112.44 270 bottom
R30  121,112.44 270 bottom
R31  116,112.44 270 bottom
R32  168,112.44 270 bottom
R33  163,112.44 270 bottom
R34  215,112.44 270 bottom
R35  204.08,117 0 bottom
R36  27.01,66.04 270 bottom
R37  21.93,66.04 270 bottom
R38  199.35,147.68 90 bottom
R39  74.09,66.04 270 bottom
R40  68.93,66.04 270 bottom
R41  121.06,66.04 270 bottom
R42  116,66.04 270 bottom
R43  167.95,66.04 270 bottom
R44  163.05,66.04 270 bottom
R45  215.01,66.04 270 bottom
R46  210.01,66.04 270 bottom
R47  26.95,19.07 270 bottom
R48  22.05,19.07 270 bottom
R49  74.09,19.07 270 bottom
R50  69.05,19.07 270 bottom
R51  121.15,19.07 270 bottom
R52  116.02,19.07 270 bottom
R53  168.07,19.07 270 bottom
R54  162.97,19.07 270 bottom
R55  72.65,55.68 270 bottom
R56  215.12,19.07 270 bottom
R57  210.05,19.07 270 bottom

### Tracks (layer width: path | path; a pad name or v marks a point on that pad's centre or on a via)
+5V  (via drill 0.76, 0.8)  (2 unrouted)
  Top 0.61: v119,60.5 120.11,59.4 IC7.16 | R1.2 199.96,79.58 199.07,78.69 LED20.VCC_IN | v186,123 186,125.78 | LED14.VCC_OUT 182.18,125.88 182.28,125.78
  Top 0.635: 41,79 LED16.VCC_OUT | 55,79 LED17.VCC_IN 55.5,78.5 | 135,79 LED18.VCC_OUT | 149,79 LED19.VCC_IN | 196,78.5 LED20.VCC_IN | 182,78.5 LED19.VCC_OUT | 88,79 LED17.VCC_OUT | 102,79 LED18.VCC_IN | 182,32 LED24.VCC_OUT | 196,32 LED25.VCC_IN | 55.5,32 LED22.VCC_IN | 102,32 LED23.VCC_IN | 88.5,32 LED22.VCC_OUT | 149,32 LED24.VCC_IN | 135,32 LED23.VCC_OUT | 55,220 LED2.VCC_IN | 41.5,220 LED1.VCC_OUT | IC5.16 119.5,199.5 102.5,216.5 102.5,219.5 LED3.VCC_IN 102,220 | 149,220 LED4.VCC_IN | 135.5,220 LED3.VCC_OUT | 196,220 LED5.VCC_IN | 182,220 LED4.VCC_OUT | 88,220 LED2.VCC_OUT | IC6.16 119.5,105.5 111,114 67,114 55.5,125.5 LED12.VCC_IN 55,126 | 41.5,126 LED11.VCC_OUT | 183,107 IC4.16 183.5,107 v183.5,108.5 | 196,125.5 LED15.VCC_IN | 135.5,126 LED13.VCC_OUT | 149,126 LED14.VCC_IN | 88,126 LED12.VCC_OUT | 102,126 LED13.VCC_IN | 55,173 LED7.VCC_IN | 41.5,173 LED6.VCC_OUT | 135,173 LED8.VCC_OUT | 149,173 LED9.VCC_IN | 196,173 LED10.VCC_IN | 182.5,173 LED9.VCC_OUT | 88,173 LED7.VCC_OUT | 102,173 LED8.VCC_IN | 8,173 LED6.VCC_IN | 8,125.5 LED11.VCC_IN | v96,32.01 v96,32
  Top 1.676: 55,79 41,79 | 149,79 135,79 | 182,78.5 196,78.5 | 102,79 88,79 | 196,32 182,32 | 88.5,32 v96,32 102,32 | 135,32 149,32 | 135.5,220 149,220 | 182,220 196,220 | 102,220 88,220 | 55,126 41.5,126 | 149,126 135.5,126 | 102,126 88,126 | 41.5,173 55,173 | 149,173 135,173 | 182.5,173 196,173 | 102,173 88,173 | 7.78,219.78 LED1.VCC_IN | LED16.VCC_IN 7.97,78.82 | LED22.VCC_IN 41.09,31.78 LED21.VCC_OUT 40.87,32 36,32 35,33 35,37 50,52 | 229,154 229,139 224,134 224,126 | 229,154 LED10.VCC_OUT | 50,52 50,59 61,70 61,76 58.5,78.5 55.5,78.5 | JP1.2 5.73,229.73 4,228 4,220 | 182.28,125.78 186,125.78 LED15.VCC_IN | 228.77,31.77 224.87,31.77 224,32.64 v224.03,78.71 229.13,78.7 | 229,126 224,126 | 224,126 224,122 v227,119 | 4,173 4,126 | 4,126 4,32 7.89,32 LED21.VCC_IN | 8,126 4,126 | 4,173 9,173 | 4,220 7.89,220 LED1.VCC_IN | LED1.VCC_IN 4.22,219.78 4,220 | 4,220 4,187 | 4,187 4,173 | 41.5,220 54.89,220 LED2.VCC_IN | v204,154 229,154 | v66,50 52,50 50,52 | v23,187 4,187
  Bottom 0.61: v183.5,108.5 183.5,120.5 v186,123 | Q2.3 30,194.54 R21.2 | R38.2 200.94,150.69 Q3.3 | Q4.3 72.49,54.1 R55.2
  Bottom 0.635: v96,32.01 96.04,46.16 110.31,60.51 v119,60.5
  Bottom 1.676: v224.03,78.71 224,88 227,91 v227,119 | Q3.3 204,150.74 v204,154 | Q4.3 67.17,51.17 v66,50 | v23,187 25.82,189.82 Q2.3
A  (via drill 0.6, 0.76)
  Top 0.61: IC7.11 126.45,60.45 v128,62 | IC6.11 126.16,107.34 v126,107.5
  Top 0.635: v125.85,202.73 125.86,199.58 IC5.11 | v127,121.5 181.5,121.5 183,120 192.5,120 192.5,108.5 J1.2
  Bottom 0.61: v128,62 128,105.5 | 127,200.5 127,201.58 v125.85,202.73
  Bottom 0.635: 128,105.5 v126,107.5 127,108.5 v127,121.5 127,200.5
B  (via drill 0.6, 0.76)
  Top 0.61: IC5.10 127.12,201.4 v128.51,202.78 | IC6.10 127.42,106.92 v128,107.5
  Top 0.635: v129.5,61.5 127.72,59.73 127.72,58.73 IC7.10 | v128.5,123 182.5,123 184,121.5 195.5,121.5 195.5,109.5 J1.1
  Bottom 0.61: 128.5,195.5 128.5,201.82 128.49,201.82 128.51,201.84 v128.51,202.78
  Bottom 0.635: 128.5,107 129.5,106 v129.5,61.5 | 128.5,107 v128,107.5 | 128.5,107 v128.5,123 128.5,195.5
C  (via drill 0.6, 0.76)
  Top 0.61: v130,201 129.11,201 128.39,200.28 IC5.9 | 175.5,110 174,110 171,107 130.5,107
  Top 0.635: 175.5,110 188.5,110 192.5,106 J1.4 | IC6.9 129,105.5 130.5,107 v130,107.5 | v133,62.5 129,58.5 IC7.9
  Bottom 0.61: 130,196 v130,201
  Bottom 0.635: v130,107.5 130,116 | 130,116 130,196 | v133,62.5 133,113 130,116
D
  Top 0.61: J1.8 191,100.56 189.81,99.36 IC4.10
E
  Top 0.61: J1.7 195.54,99.64 194,98.1
  Top 0.635: IC4.9 183.54,98.09 194,98.1
EN  (via drill 0.6, 0.76)
  Top 0.61: IC7.6 126.45,54.45 127,55 131,55 v132,56 | IC5.6 125.83,193.28 125.83,191.9 126.67,191.06 132.94,191.06 v135.5,188.5 | R1.1 199.96,92.96 200,93 200,97 198,99 198,103.14 196.84,104.3 195.6,104.3 J1.5 | IC6.6 126.16,96.66 v126,96.5
  Top 0.635: v168.5,100.5 177,100.5 IC4.6 | 200,93 188,93 v182.5,87.5
  Bottom 0.61: 134.5,61 134.5,58.5 v132,56 128,56 126,58 v126,96.5
  Bottom 0.635: 155.5,87.5 134.5,66.5 134.5,61 | 155.5,87.5 157,89 | 157,89 v168.5,100.5 | v135.5,188.5 157,166 157,89 | 155.5,87.5 v182.5,87.5
GND  (via drill 0.76)
  Top 0.61: v170,99 170.37,99.36 IC4.7 | IC4.8 IC4.7 | IC4.7 177.22,99.38 179.06,99.38 179.48,99.8 179.48,104 179.03,104.44 IC4.3
  Top 0.635: OS10.E 168,167 163,167 OS10.K 162.5,167 152,177.5 149.5,177.5 LED9.GND_IN 149,178 | OS11.E 215,167 210,167 OS11.K 209.5,167 199,177.5 196.5,177.5 LED10.GND_IN 196,178 | 182.5,178 LED9.GND_OUT | OS9.E 121,167 116,167 OS9.K 115.5,167 105,177.5 102.5,177.5 LED8.GND_IN 102,178 | OS8.E 74,167 69,167 OS8.K 68.5,167 58,177.5 | 58,177.5 55.5,177.5 LED7.GND_IN 55,178 | 88,178 LED7.GND_OUT | 41.5,178 LED6.GND_OUT | 135,178 LED8.GND_OUT | OS2.K 69,214 74,214 OS2.E | OS2.K 68.5,214 58,224.5 55.5,224.5 LED2.GND_IN 55,225 | 41.5,225 LED1.GND_OUT | 128.5,193.5 127,193.5 IC5.7 | 128.5,193.5 143,208 167,208 169.5,210.5 169.5,213.5 168.5,213.5 OS5.E 168,214 163,214 OS5.K 162.5,214 152,224.5 149.5,224.5 LED4.GND_IN 149,225 | 128.5,193.5 IC5.8 | OS6.E 215,214 210,214 OS6.K 209.5,214 199,224.5 196.5,224.5 LED5.GND_IN 196,225 | OS3.E 121,214 116,214 OS3.K 115.5,214 105,224.5 102.5,224.5 LED3.GND_IN 102,225 | 135.5,225 LED3.GND_OUT | 182,225 LED4.GND_OUT | 88,225 LED2.GND_OUT | 58,177.5 58,213.5 68.5,213.5 OS2.K | OS13.E 74,120 69,120 OS13.K 68.5,120 58,130.5 55.5,130.5 LED12.GND_IN 55,131 | 21.5,120 OS12.K | 8.5,130.5 LED11.GND_IN | 41.5,131 LED11.GND_OUT | IC6.7 127.5,99.5 128.5,99.5 IC6.8 129,99 v170,99 | 210,120 OS16.K 209.5,120 | 215,120 OS16.E | 196.5,130.5 LED15.GND_IN 196,131 | OS15.E 168,120 163,120 OS15.K 162.5,120 121.5,120 OS14.E 121,120 | 116,120 OS14.K 115.5,120 | 102.5,130.5 LED13.GND_IN 102,131 | 149,131 LED14.GND_IN | 135.5,131 LED13.GND_OUT | 182,131 LED14.GND_OUT | 88,131 LED12.GND_OUT | OS26.E 215,26 210,26 OS26.K 209.5,26 199,36.5 196.5,36.5 LED25.GND_IN 196,37 | OS25.E 168,26 163,26 OS25.K 162.5,26 152,36.5 149.5,36.5 LED24.GND_IN 149,37
  Top 0.635: IC7.7 128,52.5 129,52.5 IC7.8 129,52 | 178,40.5 181.5,37 LED24.GND_OUT 182,37 | OS22.K 22,26 27,26 OS22.E 27.5,26 | 40.5,37 LED21.GND_OUT 41,37 | OS23.K 69,26 74,26 OS23.E 74.5,26 85,36.5 88,36.5 LED22.GND_OUT 88.5,37 | OS24.E 121,26 116,26 OS24.K 115.5,26 105,36.5 102.5,36.5 LED23.GND_IN 102,37 | 55,37 LED22.GND_IN | 135,37 LED23.GND_OUT | 22,73 OS17.K | 27,73 OS17.E | 21.5,73 OS17.K | 8.5,83.5 LED16.GND_IN | 69,73 OS18.K 68.5,73 | 74,73 OS18.E | 55.39,83.91 LED17.GND_IN 55,84 | 102,84 LED18.GND_IN | 88,84 LED17.GND_OUT | 41,84 LED16.GND_OUT | OS19.K 116,73 121,73 OS19.E 121.5,73 162.5,73 OS20.K 163,73 168,73 OS20.E 168.5,73 179,83.5 181.5,83.5 LED19.GND_OUT 182,84 | 210,73 OS21.K | 215,73 OS21.E 215.5,73 | 228.5,83.5 LED20.GND_OUT | 196,84 LED20.GND_IN | 135,84 LED18.GND_OUT | 149,84 LED19.GND_IN | 20.5,72.5 21.5,72.5 OS17.K
  Top 1.676: 196,178 182.5,178 | 88,178 102,178 | 55,178 41.5,178 | 135,178 149,178 | 55,225 41.5,225 | 135.5,225 149,225 | 182,225 196,225 | 102,225 88,225 | 21.5,120 11,130.5 8.5,130.5 | 41.5,131 55,131 | 215,120 210,120 | 209.5,120 199,130.5 196.5,130.5 | 121,120 116,120 | 115.5,120 105,130.5 102.5,130.5 | 135.5,131 149,131 | 182,131 196,131 | 102,131 88,131 | 182,37 196,37 | 102,37 88.5,37 | 55,37 41,37 | 135,37 149,37 | 27,73 22,73 | 21.5,73 11,83.5 8.5,83.5 | 74,73 69,73 | 68.5,73 57.89,83.91 55.39,83.91 | 88,84 102,84 | 55,84 41,84 | 215,73 210,73 | 196,84 182,84 | 149,84 135,84 | LED21.GND_IN 18,47.17 18,71 19.77,72.77 OS17.K
  Bottom 0.635: v170,99 170,118 168.5,119.5 OS15.E
  pour Top (isolate 1): 3,3 234,3 234,233 3,233
  pour Bottom (isolate 1): 3,3 235,3 235,234 3,234
N$1  (via drill 0.76, 0.8)
  Top 1.27: v165.58,111.45 163.63,109.5 121.1,109.5 v120.96,109.36
  Top 1.676: v186.96,112.35 172.61,112.35 171.73,111.47 165.6,111.47 v165.58,111.45
  Bottom 0.61: R25.2 210,158
  Bottom 0.635: 22,65 R37.2 | 27,65 R36.2 | 22,111 R27.2 | 27,111 R26.2 | 69,111 R29.2
  Bottom 1.27: 27,65 24.5,65 | 24.5,65 22,65 | 24.5,111 27,111 69,111 | 24.5,111 22,111 | 24.5,111 24.5,65 | v120.96,109.36 121,110 R30.2
  Bottom 1.422: R29.2 R28.2 R31.2 R30.2 | R32.2 R33.2 165.15,111.02 arc90 v165.58,111.45
  Bottom 1.676: 202.55,115.72 202.55,116.89 R35.2 | 202.55,115.72 190.33,115.72 v186.96,112.35 | 217.14,158.1 R24.2 R25.2 210,148.63 Q3.4 210,148.13 210,132 221,121 221,114 218.02,111.02 R34.2 212.98,111.02 209.38,114.62 203.65,114.62 202.55,115.72 | R23.2 R22.2 209.9,158.1 210,158 210.25,157.75
N$3
  Top 1.676: 4.27,78.81 8.27,78.81
N$4
  Top 1.676: 228.87,219.87 223,214 223,174.08 224.14,172.96 228.9,172.95 229,173
N$7
  Bottom 1.676: R13.2 R14.2 R11.2 R12.2 R9.2 R10.2 R7.2 R8.2 R5.2 R6.2 21.89,204.97 19.62,202.7 Q2.4 19.62,190.51 | R19.2 R20.2 R17.2 R18.2 R15.2 R16.2 21.92,158.14 18.86,158.14 17,160 17,187.99 17.1,187.99 19.62,190.51 | 19.52,190.51 19.62,190.51
N$11
  Bottom 0.635: R6.1 22,208 22,211 OS4.A
N$12  (via drill 0.6)
  Top 0.61: IC5.13 123.31,202.38 v122.71,202.99 | v35,203 34.62,203 v29.78,207.84
  Bottom 0.61: v122.71,202.99 122.42,203 v35,203 | v29.78,207.84 26.9,207.84 R5.1
  Bottom 0.635: R5.1 27,208 27,211 OS4.C
N$13
  Top 0.635: IC5.14 122,199 122,197.5 88,197.5 74.5,211 OS2.C
  Bottom 0.635: R7.1 74,208 74,211 OS2.C
N$14
  Top 0.61: IC5.15 120.78,210.97 OS3.C
  Top 0.635: 121,211 OS3.C
  Bottom 0.635: R9.1 121,208.5 121,211 OS3.C
N$15
  Bottom 0.635: R8.1 69,208.5 69,211 OS2.A
N$16
  Top 0.61: 119.5,190 124.5,185 189,185 194,190
  Top 0.635: 119.5,190 119.5,193 IC5.1 | 194,190 215,211 OS6.C
  Bottom 0.635: R13.1 215,211 OS6.C
N$17  (via drill 0.8)
  Top 0.61: IC6.13 123.61,102.72 124.15,102.18 132.16,102.18 133.22,103.24 158.24,103.24 v160,105
  Bottom 0.61: v160,105 160,106.5 | 166.5,168.5 170.5,168.5 172,167 172,165.5 170.75,164.25 168.04,164.25 OS10.C
  Bottom 0.635: R22.1 168,164 OS10.C 168,164.5 | 160,106.5 160,166 162.5,168.5 166.5,168.5
N$18
  Bottom 0.635: R10.1 116,208.5 116,211 OS3.A
N$19
  Bottom 0.635: R23.1 163,164 OS10.A
N$20
  Top 0.61: 166.5,209.5 128.33,209.5 124.53,205.7 124.53,199.51 IC5.12
  Top 0.635: 166.5,209.5 168,211 OS5.C | 124.58,199.49 IC5.12
  Bottom 0.635: R11.1 168,208.5 168,211 OS5.C
N$21
  Bottom 0.635: R12.1 163,208.5 163,211 OS5.A
N$22  (via drill 0.76)
  Top 0.61: IC6.14 122.35,106.65 121.29,107.71 120.26,107.71 119,108.97 119,111 120,112 124,112 124.96,112.96 v124.96,113.46 | 213.5,162.5 211,160 141,160 138,163
  Top 0.635: 138,163 v125.5,163 | 213.5,162.5 215,164 OS11.C | IC6.14
  Bottom 0.61: v124.96,113.46 124.96,115.96 125.5,116.5
  Bottom 0.635: R24.1 215,164 OS11.C | v125.5,163 125.5,116.5
N$23
  Bottom 0.635: R25.1 210,164 OS11.A
N$24
  Bottom 0.635: R14.1 210,211 OS6.A
N$25
  Bottom 0.635: R27.1 22,117 OS12.A
N$26  (via drill 0.6)
  Top 0.61: v124.88,177.99 119.89,173 v113,173 | IC5.5 124.58,192.81 124.58,191.42 125,191 125,187.57 v124.88,187.45
  Bottom 0.61: v124.88,187.45 v124.88,177.99 | v113,173 108.5,168.5 95,168.5 | R15.1 58.4,160.9 66,168.5
  Bottom 0.635: R15.1 27,164 OS7.C | 66,168.5 95,168.5 95.5,168.5
N$27
  Bottom 0.635: R16.1 21.95,164.04 OS7.A
N$28  (via drill 0.76)
  Top 0.635: v131,103.5 124.9,103.49 124.89,105.03 IC6.12 | v131.5,112.5 128.5,115.5 76,115.5 74.5,117 OS13.C
  Bottom 0.635: R28.1 74,117 OS13.C | v131,103.5 131.5,104 v131.5,112.5
N$29
  Top 0.61: 101.5,195.5 101.47,195.53 92.3,195.53 78.39,181.62 78.39,167.38 75.5,164.5 | IC5.2 120.78,195.28 120.76,195.46
  Top 0.635: 101.5,195.5 120.76,195.46 | 75.5,164.5 74.5,164.5 OS8.C
  Bottom 0.635: R17.1 74,164 OS8.C
N$30
  Bottom 0.635: R18.1 69,164 OS8.A
N$32  (via drill 0.76)
  Top 0.61: v123.5,189.5 123.32,189.68 123.32,192.04
  Top 0.635: 123.32,192.04 123.33,192.96 IC5.4
  Bottom 0.635: R19.1 121,164 OS9.C 121.5,164.5 123.5,166.5 v123.5,189.5
N$33
  Bottom 0.635: R20.1 116,164 OS9.A
N$34
  Bottom 0.635: R29.1 69,117 OS13.A
N$36
  Bottom 0.635: R31.1 116,117 OS14.A
N$37  (via drill 0.8)
  Top 0.61: IC6.5 124.89,101.11 125,101.23 v135.93,101.22 | v152,112 163,112 163.5,112.5
  Top 0.635: 163.5,112.5 168,117 OS15.C
  Bottom 0.61: v135.93,101.22 141.22,101.22 v152,112
  Bottom 0.635: R32.1 168,117 OS15.C
N$38
  Bottom 0.635: R33.1 163,117 OS15.A
N$39  (via drill 0.8)
  Top 0.61: 121.06,94.43 123.2,92.3 181.94,92.3 184.06,94.42 196.46,94.42 v197.63,95.59
  Top 0.635: 121.06,94.43 121.07,98.01 IC6.2 | OS16.C 215,117 v215,96.04 215,96
  Bottom 0.61: v197.63,95.59 214.55,95.59 v215,96.04
  Bottom 0.635: R34.1 215,117 OS16.C
N$40
  Bottom 0.635: R35.1 210,117 OS16.A
N$42
  Top 0.61: 28.5,70.5 30.5,72.5 30.5,90.89 41.11,101.5 55,101.5
  Top 0.635: 54.5,101.5 55,101.5 122.5,101.5 123.62,100.35 123.63,99.37 IC6.4 | 28.5,70.5 27.5,70.5 OS17.C
  Bottom 0.635: R36.1 27,68 27,70 OS17.C
N$43
  Bottom 0.635: R37.1 22,67.5 22,70 OS17.A
N$45
  Top 0.635: IC6.15 121.09,104.97 121.08,103.49 41,103.5 27.5,117 OS12.C
  Bottom 0.635: R26.1 27,117 OS12.C
N$46  (via drill 0.76)
  Top 0.61: v117.5,98 118.5,98 IC6.1
  Bottom 0.61: 121.5,107.5 121.46,107.54 116,107.54 114,105.54 114,99.82 115.81,98.01 v117.49,98.01 v117.5,98
  Bottom 0.635: OS14.C 121,117 R30.1 121,114 123,112 123,109 121.5,107.5
N$47  (via drill 0.76)
  Top 0.61: v123.7,61.63 123.92,61.41 IC7.13
  Top 0.635: 123.92,57.99 IC7.13
  Bottom 0.61: 75.5,71.5 78.5,74.5 79,74.5
  Bottom 0.635: R39.1 74,67.5 74,70 OS18.C 74.5,70.5 75.5,71.5 | v123.7,61.63 123,63.5 123,73 121.5,74.5 79,74.5
N$48
  Bottom 0.635: R40.1 69,67.5 69,70 OS18.A
N$49
  Top 0.635: IC7.14 122.5,58.5 122.5,70 121.5,70 OS19.C
  Bottom 0.635: R41.1 121,67.5 121,70 OS19.C
N$50
  Bottom 0.635: OS19.A R42.1
N$51
  Bottom 0.635: R44.1 163,67.5 163,70 OS20.A
N$52
  Top 0.61: IC7.12 125.2,64.19 127.85,66.84 211.84,66.84 213.5,68.5
  Top 0.635: 213.5,68.5 215,70 OS21.C | IC7.12
  Bottom 0.635: R45.1 215,67.5 215,70 OS21.C
N$53
  Bottom 0.635: R46.1 210,67.5 210,70 OS21.A
N$54
  Bottom 0.635: R48.1 22,21 22,23 OS22.A
N$55  (via drill 0.76)
  Top 0.61: 125.16,52.14 125.16,47.73 v126.44,46.45 | v127,25.5 127,23.5 122.5,19 78.24,19 OS23.C
  Top 0.635: 125.16,52.14 IC7.5 | 74.5,23 OS23.C
  Bottom 0.61: v127,25.5 127.03,45.86 v126.44,46.45
  Bottom 0.635: R49.1 74,21 74,23 OS23.C
N$56
  Bottom 0.635: R50.1 69,21 69,23 OS23.A
N$57
  Top 0.61: OS24.C 122.64,23.23 123.35,23.94 123.35,27.15 121.5,29
  Top 0.635: 121.5,29 121.5,52 IC7.2
  Bottom 0.635: R51.1 121,20 121,23 OS24.C
N$58
  Bottom 0.635: R52.1 116,20 116,23 OS24.A
N$60
  Top 0.61: 124,46 127,43 156,43 172,27 172,24 171.5,23.5 169.5,23.5
  Top 0.635: 124,46 124,52 IC7.4 | 169.5,23.5 168.5,23.5 OS25.C
  Bottom 0.635: R53.1 168,20 168,23 OS25.C
N$61
  Bottom 0.635: R54.1 163,20 163,23 OS25.A
N$63  (via drill 0.6)
  Top 0.61: v121.2,60.99 121.38,60.81 IC7.15
  Bottom 0.61: 121.5,56.5 121.5,60.69 v121.2,60.99 | 132,51 127,51 123.5,54.5 | 155.5,74.5 157,76 172,76 173.45,74.55 173.45,71.45 172.18,70.18 OS20.C
  Bottom 0.635: R43.1 168,67.5 168,70 OS20.C 168,70.5 | 123.5,54.5 121.5,56.5 | 155.5,74.5 132,51
N$64
  Top 0.61: 51,23.5 56.5,23.5 79,46 114,46
  Top 0.635: 114,46 120,52 IC7.1 | 51,23.5 27.5,23.5 OS22.C
  Bottom 0.635: R47.1 27,21 27,23 OS22.C
N$68  (via drill 0.8)
  Top 1.27: v194.91,64.45 v173.7,64.45
  Bottom 0.61: 68.91,17.72 68.98,17.72 R50.2
  Bottom 0.635: 69,64.5 R40.2 68.5,64.5 | 74,64.5 R39.2 74.5,64.5 | 116,64.5 R42.2 | 215,64.5 R45.2 | 167.5,64.5 R43.2 | 209.5,64.5 R46.2
  Bottom 1.27: R41.2 121,64.5 116,64.5 74.5,64.5 | 74,64.5 69,64.5 | 163.5,64.5 R44.2 163.17,64.5 167.5,64.5 | 220,21 220,59.62 215.12,64.5 215,64.5 | 68.91,17.72 61,17.72 | 61,17.72 R47.2 | 26.93,17.7 R48.2 | 61,17.72 61,56.38 Q4.4 60.97,61.59 64,64.62 R40.2 | 167.83,64.5 R43.2 168.12,64.45 v173.7,64.45 | R46.2 R45.2 | R52.2 115.97,17.7 R49.2 R50.2 | 209.5,64.5 194.96,64.5 v194.91,64.45
  Bottom 1.422: R52.2 121.15,17.6 R51.2 R54.2 168.07,17.74 R53.2 210.05,17.72 R57.2 R56.2 216.65,17.65 220,21
  Bottom 1.676: R47.2 26.93,17.7
N$69  (via drill 0.6, 0.76)
  Top 0.61: 172.39,97.2 v172.37,97.22 173.59,96 180,96 181.08,97.08 181.08,101.15 181.84,101.91 IC4.12 | v169,125 133.86,160.14 v118.55,160.14
  Top 0.635: v122,191.5 122,193 IC5.3
  Bottom 0.61: v172.37,97.22 172.37,121.63 v169,125
  Bottom 0.635: v122,191.5 118.62,188.1 v118.55,160.14
N$70  (via drill 0.6)
  Top 0.61: v185.46,104.48 185.43,104.44 IC4.14 | v177,94 124.5,94 122.35,96.11
  Top 0.635: 122.35,96.11 122.34,98.86 IC6.3
  Bottom 0.61: 182,99 185.46,102.46 v185.46,104.48 | 179,96 v177,94
  Bottom 0.635: 182,99 179,96
N$71  (via drill 0.6, 0.76)
  Top 0.61: 185.75,105.74 185.77,105.76 186.42,105.76 v187.68,104.5 | 114.5,60 110,64.5 110,70 115.45,75.45 167.95,75.45 168,75.5
  Top 0.635: 114.5,60 119.5,55 122.64,55 122.64,52.5 IC7.3 | v185.5,93 168,75.5 | 185.75,105.74 183.6,105.74 IC4.15
  Bottom 0.61: v187.68,104.5 187.68,95.18 187,94.5
  Bottom 0.635: 187,94.5 v185.5,93
N$72  (via drill 0.76)
  Top 0.635: v185.68,100.64 183.61,100.63 IC4.11
  Bottom 0.635: R56.1 215,20.5 OS26.C 215,23.5 184,54.5 184,99 v185.68,100.64
N$75
  Bottom 0.635: R57.1 210,20.5 210,23 OS26.A
N$117
  Top 0.635: 41.5,222.5 LED1.D_OUT | 55,222.5 LED2.D_IN
  Top 1.676: 55,222.5 41.5,222.5
N$118
  Top 0.635: 102,222.5 LED3.D_IN | 88,222.5 LED2.D_OUT
  Top 1.676: 88,222.5 102,222.5
N$119
  Top 0.635: 135.5,222.5 LED3.D_OUT | 149,222.5 LED4.D_IN
  Top 1.676: 149,222.5 135.5,222.5
N$120
  Top 0.635: 196,222.5 LED5.D_IN | 182,222.5 LED4.D_OUT
  Top 1.676: 182,222.5 196,222.5
N$123
  Top 0.635: 41.5,175.5 LED6.D_OUT | 55,175.5 LED7.D_IN
  Top 1.676: 55,175.5 41.5,175.5
N$124
  Top 0.635: 102,175.5 LED8.D_IN | 88,175.5 LED7.D_OUT
  Top 1.676: 88,175.5 102,175.5
N$125
  Top 0.635: 135,175.5 LED8.D_OUT | 149,175.5 LED9.D_IN
  Top 1.676: 149,175.5 135,175.5
N$126
  Top 0.635: 182.5,175.5 LED9.D_OUT | 196,175.5 LED10.D_IN
  Top 1.676: 196,175.5 182.5,175.5
N$127
  Top 0.635: 41.5,128.5 LED11.D_OUT | 55,128.5 LED12.D_IN
  Top 1.676: 55,128.5 41.5,128.5
N$128
  Top 0.635: 88,128.5 LED12.D_OUT | 102,128.5 LED13.D_IN
  Top 1.676: 102,128.5 88,128.5
N$129
  Top 0.635: 135.5,128.5 LED13.D_OUT | 149,128.5 LED14.D_IN
  Top 1.676: 149,128.5 135.5,128.5
N$130
  Top 0.635: 196,128.5 LED15.D_IN | 182,128.5 LED14.D_OUT
  Top 1.676: 182,128.5 196,128.5
N$131
  Top 0.635: 41,81.5 LED16.D_OUT | 55,81.5 LED17.D_IN
  Top 1.676: 55,81.5 41,81.5
N$132
  Top 0.635: 88,81.5 LED17.D_OUT | 102,81.5 LED18.D_IN
  Top 1.676: 102,81.5 88,81.5
N$133
  Top 0.635: 135,81.5 LED18.D_OUT | 149,81.5 LED19.D_IN
  Top 1.676: 149,81.5 135,81.5
N$134
  Top 0.635: 182,81.5 LED19.D_OUT | 196,81.5 LED20.D_IN
  Top 1.676: 196,81.5 182,81.5
N$135
  Top 0.635: 55,34.5 LED22.D_IN | 41,34.5 LED21.D_OUT
  Top 1.676: 41,34.5 55,34.5
N$136
  Top 0.635: 88.5,34.5 LED22.D_OUT | 102,34.5 LED23.D_IN
  Top 1.676: 102,34.5 88.5,34.5
N$137
  Top 0.635: 135,34.5 LED23.D_OUT | 149,34.5 LED24.D_IN
  Top 1.676: 149,34.5 135,34.5
N$138
  Top 0.635: 196,34.5 LED25.D_IN | 182,34.5 LED24.D_OUT
  Top 1.676: 182,34.5 196,34.5
SECTION_1_EN  (via drill 0.76, 0.8)
  Top 0.61: 64,161.5 63.81,161.5 v58.85,166.46 | 177,107 177,108.15 v177.37,108.52
  Top 0.635: v167.5,129.5 135.5,161.5 64,161.5 | 177,107 IC4.1
  Bottom 0.61: v177.37,108.52 177.37,126.13 174,129.5 | Q2.1 30.22,199.16 R21.1 37.62,198.38 58.85,177.15 v58.85,166.46
  Bottom 0.635: v167.5,129.5 174,129.5
SECTION_2_EN  (via drill 0.76)
  Top 0.61: v174,126 174,142 178.23,146.23 v193.4,146.23 | IC4.5 175.09,101.91 arc-90 v175,102
  Bottom 0.61: v193.4,146.23 193.43,146.26 R38.1 198.54,146.07 Q3.1
  Bottom 0.635: v175,102 174,103 v174,126
SECTION_3_EN  (via drill 0.6, 0.76, 0.8)  (1 unrouted)
  Top 0.61: IC4.4 175.44,103.17 174.5,104.12 174.51,105.73 174.51,107.34 v175.53,108.36 | v172,91 123,91 v89,57
  Top 0.635: 174.51,105.73 177.13,105.73 IC4.2
  Bottom 0.61: v172,91 172,93 177,98 177,103 175.5,104.5 175.5,107 | Q4.1 71.03,58.72 R55.1 72.75,57 v89,57
  Bottom 0.635: v175.53,108.36 175.5,107
  other vias: 89,57.06
SENSOR
  Top 0.635: 183.58,103.17 IC4.13 183.47,103.18 192.52,103.2 J1.6

### Text on the board
Bottom: LED TABLE V3 / 2016